# EAGLE board PX4FMUv2.4 (EAGLE 6.6.0), part 1 of 2
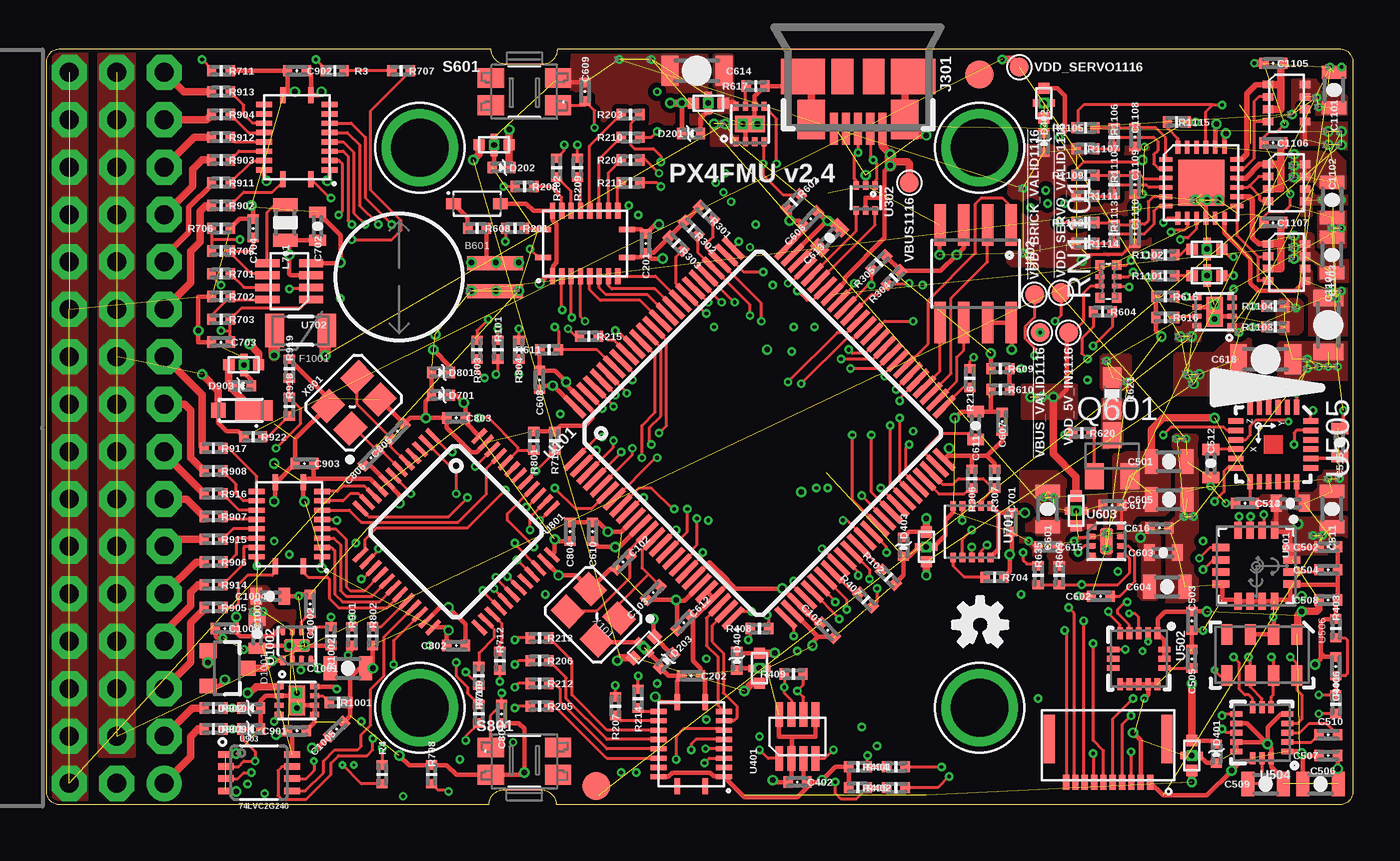
[diagram p12: board, top side]
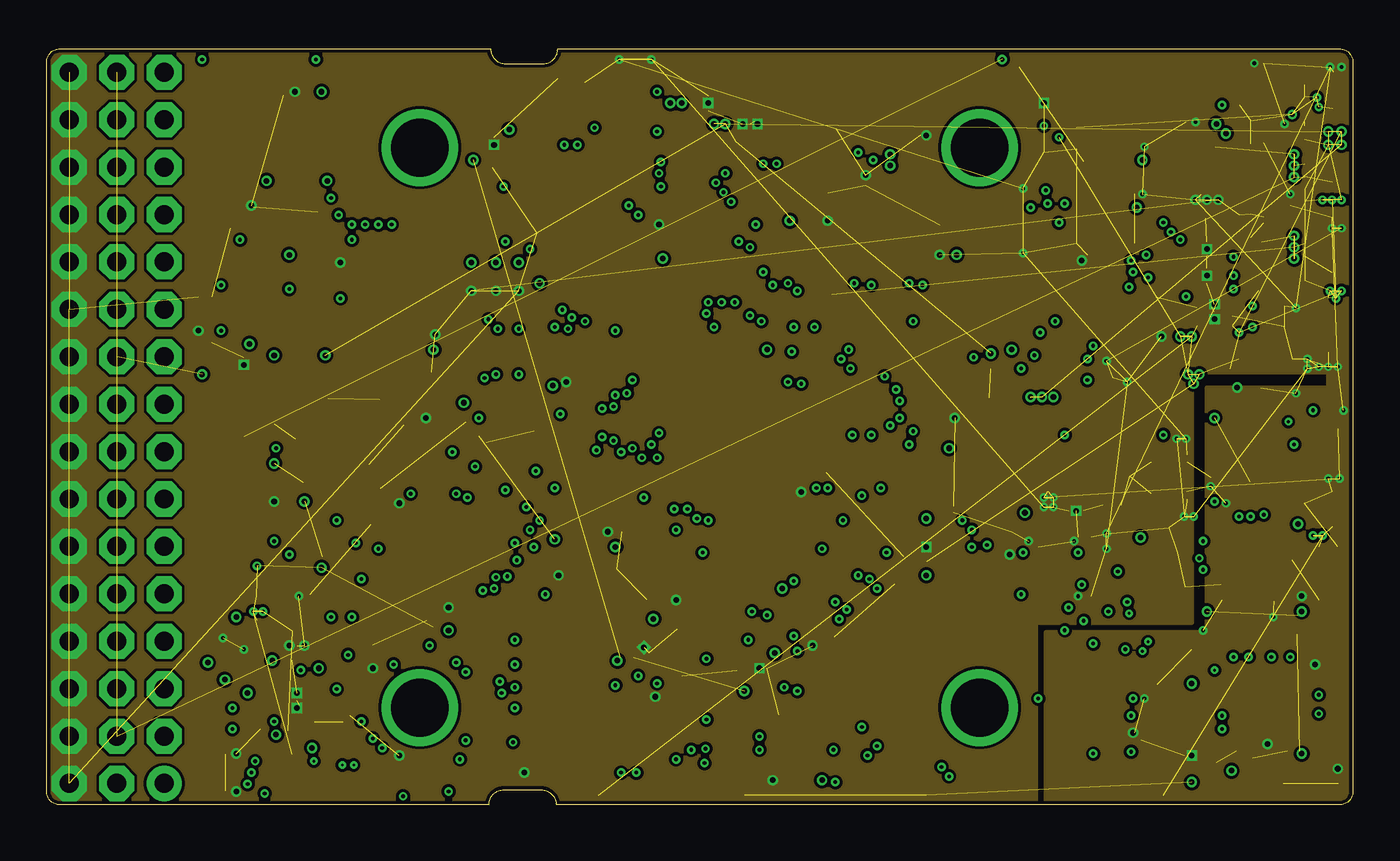
[diagram p13: board, inner layer Ground]
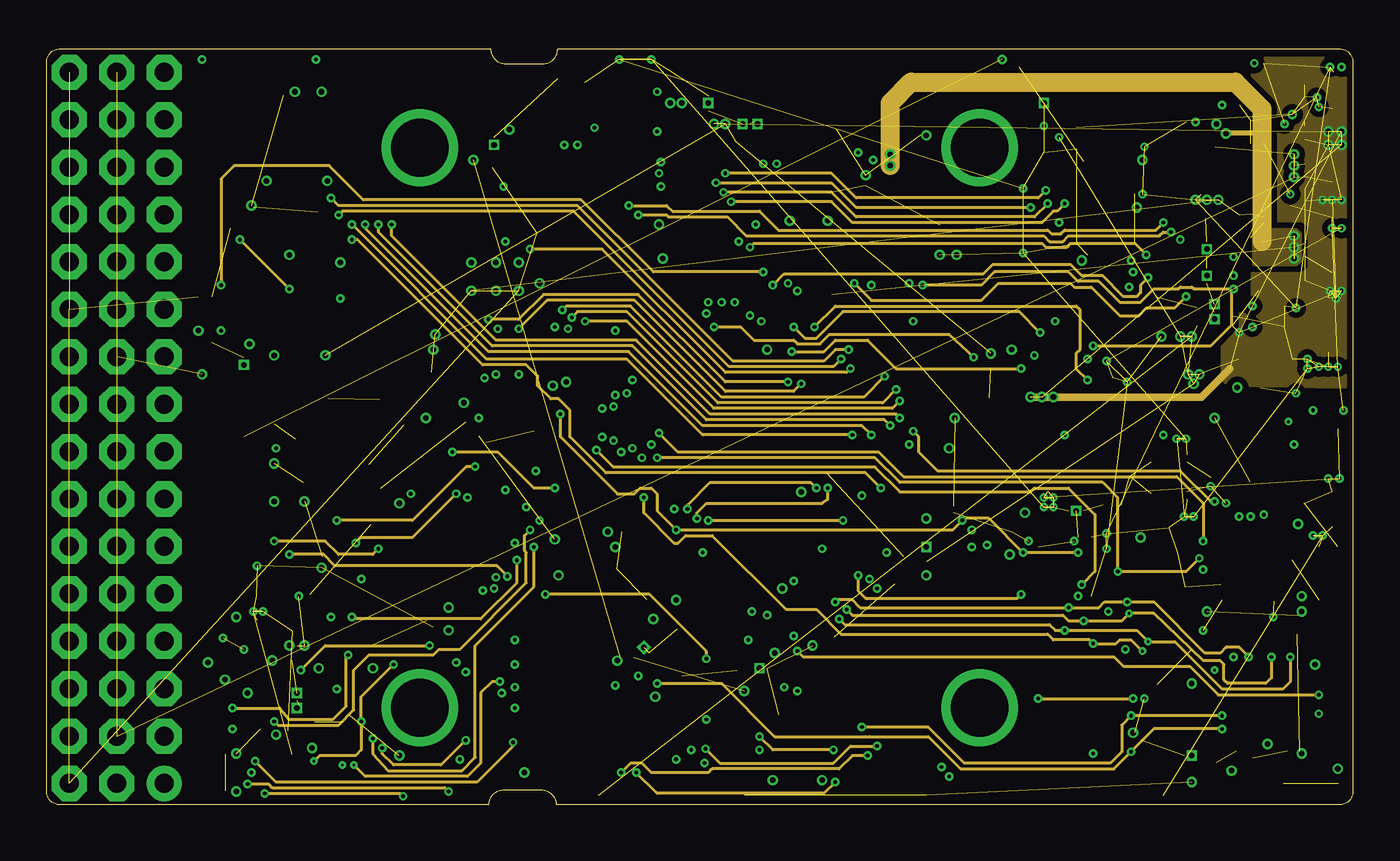
[diagram p14: board, inner layer Horizontal]
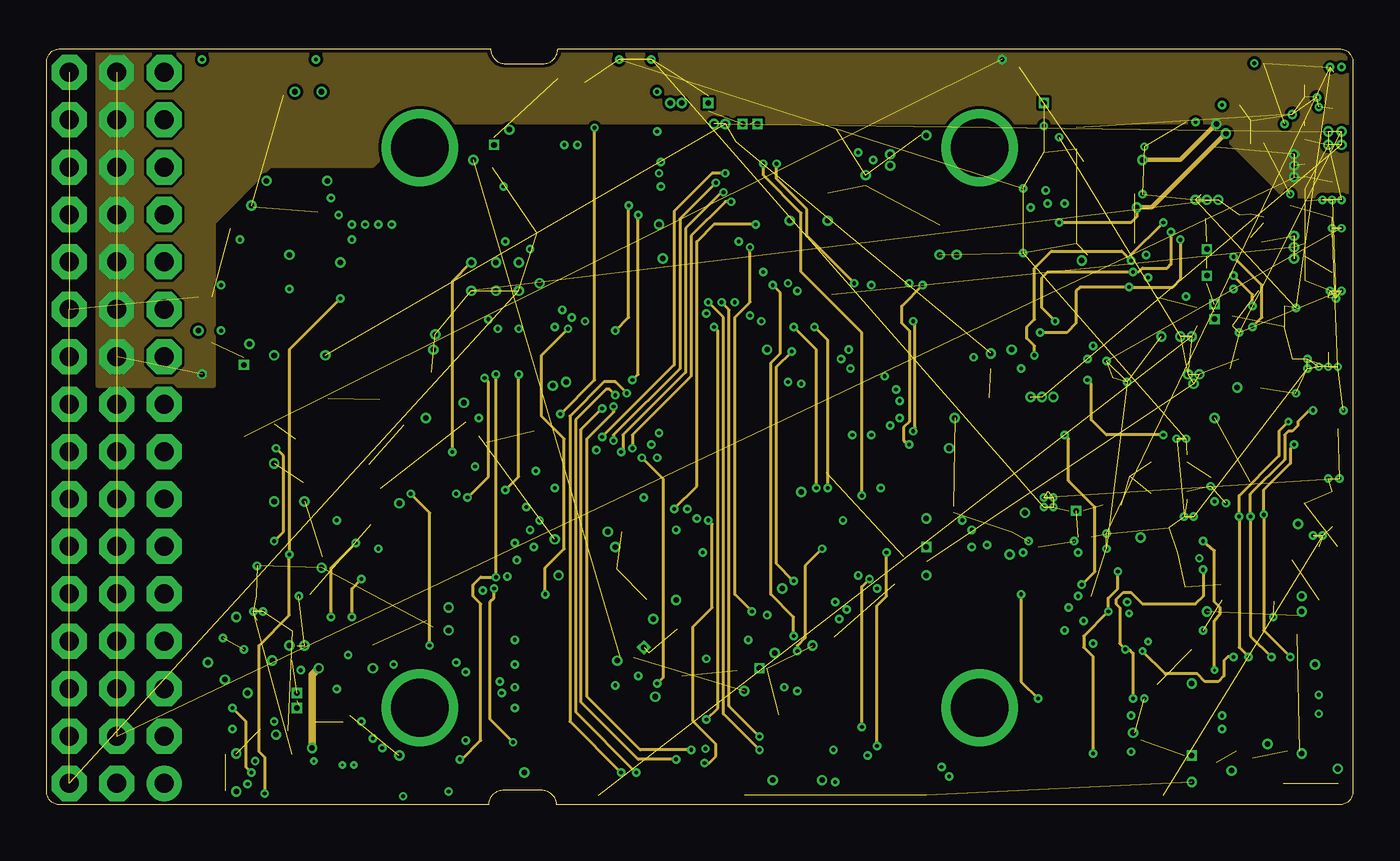
[diagram p15: board, inner layer Vertical]
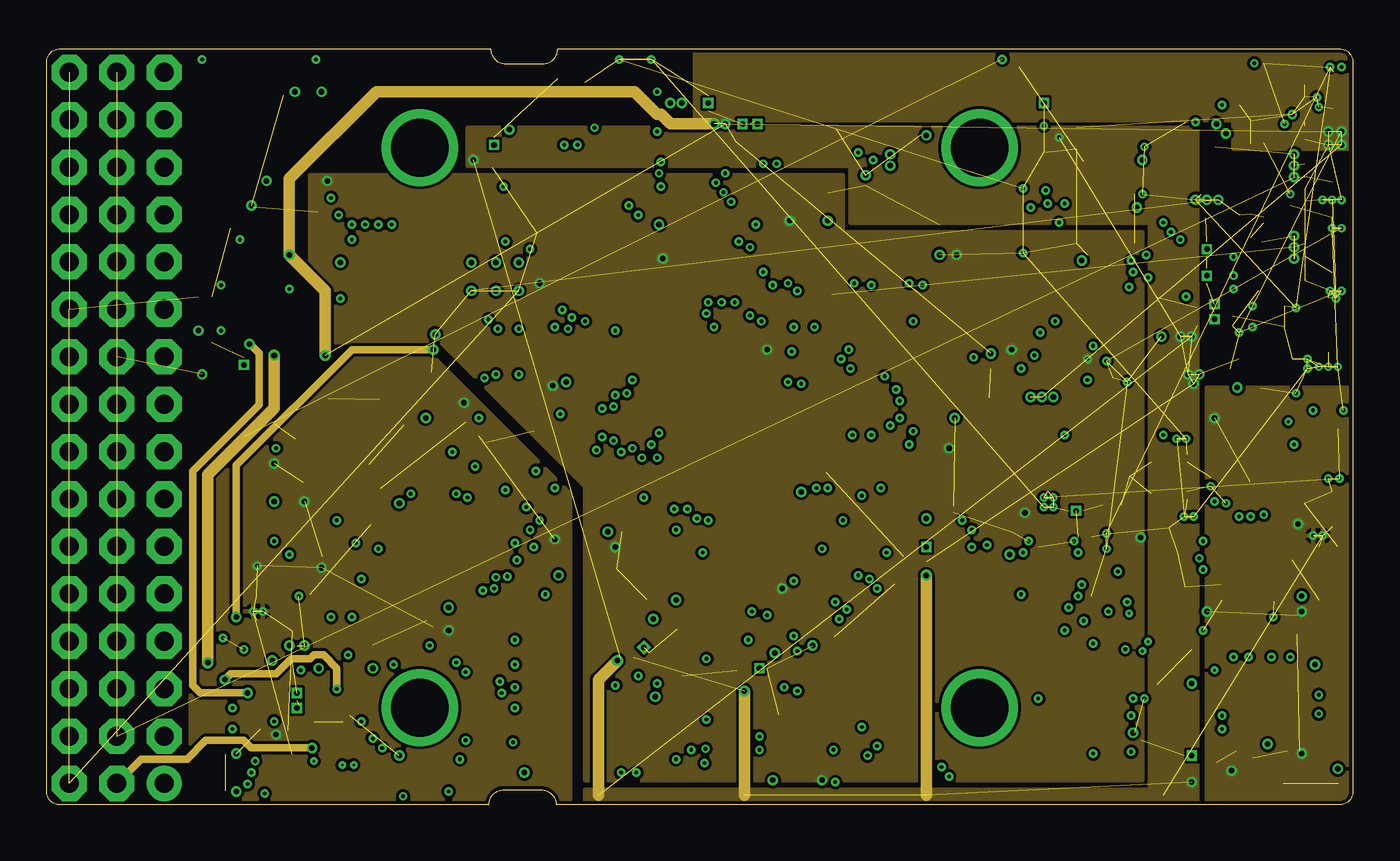
[diagram p16: board, inner layer Power]
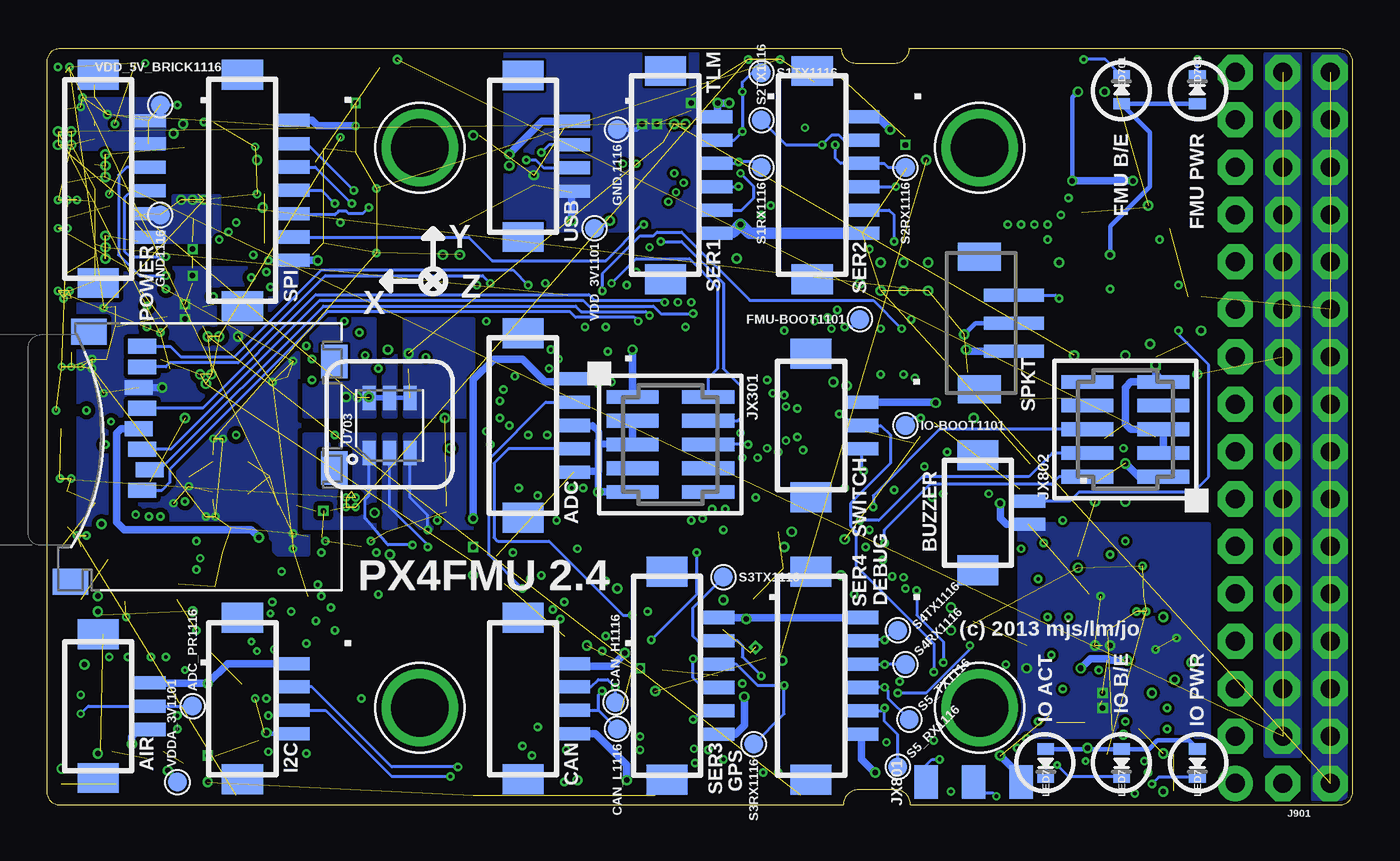
[diagram p17: board, bottom side, seen from below]

Size 70 x 40.5 mm. Coordinates in mm from the lower left corner, seen from the top.
Outline: 23.7,0 0.7,0 arc-90 0,0.7 0,39.8 arc-90 0.7,40.5 23.8,40.5 arc90 24.59,39.7 26.59,39.7 arc90 27.39,40.5 69.3,40.5 arc-90 70,39.8 70,0.7 arc-90 69.3,0 27.3,0 arc90 26.5,0.8 24.5,0.8 arc90 23.7,0
Copper layers (1*2*3*14*15*16): Top 0.035mm / dielectric 0.5mm / Ground 0.035mm / dielectric 0.15mm / Horizontal 0.035mm / dielectric 0.15mm / Vertical 0.035mm / dielectric 0.15mm / Power 0.035mm / dielectric 0.5mm / Bottom 0.035mm
Design rules "default *": minimum track width 0.15mm, minimum drill 0.2mm, track to track 5mil, track to pad 5mil, pad to pad 5mil, via to via 5mil, smd to smd 0mil, copper to edge 0.2mm, drill to drill 0.2mm, minimum pad ring 0.125mm, minimum via ring 0.125mm, stop-mask expansion 1mil, vias tented up to drill 0.31mm, thermal gap 8mil
Net classes: 0 signal: width 0.15 mm, drill 0.15 mm, clearance 0.152 mm; 1 power: width 0.15 mm, drill 0.2 mm, clearance 0.152 mm

## Footprints (pad centres in the part's own frame; a part is rotated, then mirrored left to right if it is on the bottom)
PAD.04X.04 = smd 1.016 x 1.016: P$1 0,0
MS621FE = smd 3 x 0.75: 1 5.15,0.75; 2 5.15,-0.75
0402-CAP = smd 0.5 x 0.6: P$1 -0.5,0; P$2 0.5,0
0805-CAP = smd 0.7 x 1.3: P$1 -0.95,0; P$2 0.95,0
0603-CAP = smd 0.6 x 0.9: P$1 -0.75,0; P$2 0.75,0
1206-CAP = smd 0.9 x 1.6: P$1 -1.45,0; P$2 1.45,0
MICROSMP = smd 0.8 x 0.8: ANODE 0.65,0 | smd 2 x 1.1: CATHODE -1.25,0
SOD323 = smd 0.8 x 0.6: A 1.25,0; C -1.25,0
0402-TVS = smd 0.5 x 0.6: A 0.5,0; C -0.5,0
SOT23-3 = smd 0.8 x 0.9: 1 -0.95,-1; 2 0.95,-1; 3 0,1.1
PTC-1206 = smd 1 x 1.8: 1 -1.4,0; 2 1.4,0
DF13C-6P-1.25V = smd 0.7 x 1.8: 1 -3.125,0.9; 2 -1.875,0.9; 3 -0.625,0.9; 4 0.625,0.9; 5 1.875,0.9; 6 3.125,0.9 | smd 1.6 x 2.2: M$0 5.575,-1.8; M$1 -5.575,-1.8
MOLEX-47346-0001 = smd 1.7 x 0.44: D+ 2.8,0; D- 2.8,0.65; GND 2.8,-1.3; ID 2.8,-0.65; VBUS 2.8,1.3 | smd 1.9 x 2.375: GND1 0,2.95; GND4 0,-2.95 | smd 2.1 x 1.475: GND2 2.3,2.5; GND3 2.3,-2.5 | smd 1.9 x 1.175: GND5 0,-0.838; GND6 0,0.838
DF13C-4P-1.25V = smd 0.7 x 1.8: 1 -1.875,0.9; 2 -0.625,0.9; 3 0.625,0.9; 4 1.875,0.9 | smd 1.6 x 2.2: M$0 4.325,-1.8; M$1 -4.325,-1.8
DF13C-3P-1.25V = smd 0.7 x 1.8: 1 -1.25,0.9; 2 0,0.9; 3 1.25,0.9 | smd 1.6 x 2.2: M$0 3.85,-1.8; M$1 -3.85,-1.8
DF13C-7P-1.25V = smd 0.7 x 1.8: 1 -3.75,0.9; 2 -2.5,0.9; 3 -1.25,0.9; 4 0,0.9; 5 1.25,0.9; 6 2.5,0.9; 7 3.75,0.9 | smd 1.6 x 2.2: M$0 6.2,-1.8; M$1 -6.2,-1.8
DF13C-5P-1.25V = smd 0.7 x 1.8: 1 -2.5,0.9; 2 -1.25,0.9; 3 0,0.9; 4 1.25,0.9; 5 2.5,0.9 | smd 1.6 x 2.2: M$0 4.95,-1.8; M$1 -4.95,-1.8
DF13C-2P-1.25V = smd 0.7 x 1.8: 1 -0.625,0.9; 2 0.625,0.9 | smd 1.6 x 2.2: M$0 3.075,-1.8; M$1 -3.075,-1.8
JST-ZH-SMT-VERTICAL = smd 0.7 x 3.2: P$1 -1.5,-1.75; P$2 0,-1.75; P$3 1.5,-1.75 | smd 1.5 x 2.3: P$4 3.55,0.1; P$5 -3.55,0.1
3X16RA = drill 1.016 pad 1.88: 1 2.54,19.05 | drill 1.016 pad 1.88 octagon: 2 0,19.05; 3 -2.54,19.05; 4 2.54,16.51; 5 0,16.51; 6 -2.54,16.51; 7 2.54,13.97; 8 0,13.97; 9 -2.54,13.97; 10 2.54,11.43; 11 0,11.43; 12 -2.54,11.43; 13 2.54,8.89; 14 0,8.89; 15 -2.54,8.89; 16 2.54,6.35; 17 0,6.35; 18 -2.54,6.35; 19 2.54,3.81; 20 0,3.81; 21 -2.54,3.81; 22 2.54,1.27; 23 0,1.27; 24 -2.54,1.27; 25 2.54,-1.27; 26 0,-1.27; 27 -2.54,-1.27; 28 2.54,-3.81; 29 0,-3.81; 30 -2.54,-3.81; 31 2.54,-6.35; 32 0,-6.35; 33 -2.54,-6.35; 34 2.54,-8.89; 35 0,-8.89; 36 -2.54,-8.89; 37 2.54,-11.43; 38 0,-11.43; 39 -2.54,-11.43; 40 2.54,-13.97; 41 0,-13.97; 42 -2.54,-13.97; 43 2.54,-16.51; 44 0,-16.51; 45 -2.54,-16.51; 46 2.54,-19.05; 47 0,-19.05; 48 -2.54,-19.05
FIDUCIAL-1.5X3 = smd 1.5 x 1.5: 1 0,0
FTSH-105-01-XXX-DV-K = smd 0.737 x 2.794: 1 -2.54,-2.032; 2 -2.54,2.032; 3 -1.27,-2.032; 4 -1.27,2.032; 5 0,-2.032; 6 0,2.032; 7 1.27,-2.032; 8 1.27,2.032; 9 2.54,-2.032; 10 2.54,2.032
HEADER_3X01_SMD_H_BOARD_EDGE_SHORT = smd 1.27 x 1.778: 1 -2.54,0; 2 0,0; 3 2.54,0
KYOCERA-KNH16-DA = smd 0.6 x 0.6: P$1 -0.8,0; P$2 0.8,0 | smd 0.4 x 0.4: P$3 0,-0.4; P$4 0,0.4 | drill 0.3 pad 0.4 square: P$5 0,0
0805-IND = smd 0.7 x 1.3: P$1 -0.95,0; P$2 0.95,0
0603-LED = smd 0.6 x 0.9: A 0.75,0; C -0.75,0
MOUNT-HOLE3.1 = drill 3.1 pad 4.1: P$1 0,0
SOT23-BEC = smd 1 x 1.4: B -0.95,-1.1; C 0,1.1; E 0.95,-1.1
0402-RES = smd 0.5 x 0.6: P$1 -0.5,0; P$2 0.5,0
0603-RES = smd 1.1 x 1: 1 -0.85,0; 2 0.85,0
EXB28V = smd 0.525 x 0.5: 1 -0.875,-0.45; 4 0.875,-0.45; 5 0.875,0.45; 8 -0.875,0.45 | smd 0.25 x 0.5: 2 -0.25,-0.45; 3 0.25,-0.45; 6 0.25,0.45; 7 -0.25,0.45
EVQP7J01K = smd 1.4 x 1.05: A1 -1.8,0.725; A2 1.8,0.725; B3 -1.8,-0.725; B4 1.8,-0.725
TQFP100 = smd 1.5 x 0.29: 1 -8,6; 2 -8,5.5; 3 -8,5; 4 -8,4.5; 5 -8,4; 6 -8,3.5; 7 -8,3; 8 -8,2.5; 9 -8,2; 10 -8,1.5; 11 -8,1; 12 -8,0.5; 13 -8,0; 14 -8,-0.5; 15 -8,-1; 16 -8,-1.5; 17 -8,-2; 18 -8,-2.5; 19 -8,-3; 20 -8,-3.5; 21 -8,-4; 22 -8,-4.5; 23 -8,-5; 24 -8,-5.5; 25 -8,-6; 51 8,-6; 52 8,-5.5; 53 8,-5; 54 8,-4.5; 55 8,-4; 56 8,-3.5; 57 8,-3; 58 8,-2.5; 59 8,-2; 60 8,-1.5; 61 8,-1; 62 8,-0.5; 63 8,0; 64 8,0.5; 65 8,1; 66 8,1.5; 67 8,2; 68 8,2.5; 69 8,3; 70 8,3.5; 71 8,4; 72 8,4.5; 73 8,5; 74 8,5.5; 75 8,6 | smd 0.29 x 1.5: 26 -6,-8; 27 -5.5,-8; 28 -5,-8; 29 -4.5,-8; 30 -4,-8; 31 -3.5,-8; 32 -3,-8; 33 -2.5,-8; 34 -2,-8; 35 -1.5,-8; 36 -1,-8; 37 -0.5,-8; 38 0,-8; 39 0.5,-8; 40 1,-8; 41 1.5,-8; 42 2,-8; 43 2.5,-8; 44 3,-8; 45 3.5,-8; 46 4,-8; 47 4.5,-8; 48 5,-8; 49 5.5,-8; 50 6,-8; 76 6,8; 77 5.5,8; 78 5,8; 79 4.5,8; 80 4,8; 81 3.5,8; 82 3,8; 83 2.5,8; 84 2,8; 85 1.5,8; 86 1,8; 87 0.5,8; 88 0,8; 89 -0.5,8; 90 -1,8; 91 -1.5,8; 92 -2,8; 93 -2.5,8; 94 -3,8; 95 -3.5,8; 96 -4,8; 97 -4.5,8; 98 -5,8; 99 -5.5,8; 100 -6,8
SO08 = smd 0.61 x 2.21: 1 -1.905,-2.616; 2 -0.635,-2.616; 3 0.635,-2.616; 4 1.905,-2.616; 5 1.905,2.616; 6 0.635,2.616; 7 -0.635,2.616; 8 -1.905,2.616
QFN20-RGY = smd 0.28 x 0.85: 1 -0.75,2.25; 10 -0.75,-2.25; 11 0.75,-2.25; 20 0.75,2.25 | smd 0.85 x 0.28: 2 -1.75,1.75; 3 -1.75,1.25; 4 -1.75,0.75; 5 -1.75,0.25; 6 -1.75,-0.25; 7 -1.75,-0.75; 8 -1.75,-1.25; 9 -1.75,-1.75; 12 1.75,-1.75; 13 1.75,-1.25; 14 1.75,-0.75; 15 1.75,-0.25; 16 1.75,0.25; 17 1.75,0.75; 18 1.75,1.25; 19 1.75,1.75
MICROSD = smd 0.8 x 1.5: 1 -1.94,2.7; 2 -0.84,2.3; 3 0.26,2.7; 4 1.36,2.9; 5 2.46,2.7; 6 3.56,2.9; 7 4.66,2.7; 8 5.76,2.7 | smd 1.4 x 1.9: NC -6.85,6.55; NC3 6.55,5.55 | smd 1.8 x 1.4: NC1 -0.75,-7.6; NC2 4.95,-7.6
SOT563-6 = smd 0.3 x 0.45: 1 -0.5,-0.675; 2 0,-0.675; 3 0.5,-0.675; 4 0.5,0.675; 5 0,0.675; 6 -0.5,0.675
SOT23-8 = smd 0.42 x 1.3: 1 -0.975,-1.175; 2 -0.325,-1.175; 3 0.325,-1.175; 4 0.975,-1.175; 5 0.975,1.175; 6 0.325,1.175; 7 -0.325,1.175; 8 -0.975,1.175
L3G4200DH-MAN = smd 0.9 x 0.4: 1 -1.9,0.975; 2 -1.9,0.325; 3 -1.9,-0.325; 4 -1.9,-0.975; 9 1.9,-0.975; 10 1.9,-0.325; 11 1.9,0.325; 12 1.9,0.975 | smd 0.4 x 0.9: 5 -0.975,-1.9; 6 -0.325,-1.9; 7 0.325,-1.9; 8 0.975,-1.9; 13 0.975,1.9; 14 0.325,1.9; 15 -0.325,1.9; 16 -0.975,1.9
LGA-16L = smd 0.65 x 0.3: 1 -1.37,1; 2 -1.37,0.5; 3 -1.37,0; 4 -1.37,-0.5; 5 -1.37,-1; 9 1.37,-1; 10 1.37,-0.5; 11 1.37,0; 12 1.37,0.5; 13 1.37,1 | smd 0.3 x 0.65: 6 -0.5,-1.37; 7 0,-1.37; 8 0.5,-1.37; 14 0.5,1.37; 15 0,1.37; 16 -0.5,1.37
QFN-24 = smd 0.8 x 0.29: 1 -2,1.25; 2 -2,0.75; 3 -2,0.25; 4 -2,-0.25; 5 -2,-0.75; 6 -2,-1.25; 13 2,-1.25; 14 2,-0.75; 15 2,-0.25; 16 2,0.25; 17 2,0.75; 18 2,1.25 | smd 0.29 x 0.8: 7 -1.25,-2; 8 -0.75,-2; 9 -0.25,-2; 10 0.25,-2; 11 0.75,-2; 12 1.25,-2; 19 1.25,2; 20 0.75,2; 21 0.25,2; 22 -0.25,2; 23 -0.75,2; 24 -1.25,2
MS5611-01BA = smd 1.1 x 0.6: 1 -1.1,1.875; 2 -1.1,0.625; 3 -1.1,-0.625; 4 -1.1,-1.875; 5 1.1,-1.875; 6 1.1,-0.625; 7 1.1,0.625; 8 1.1,1.875
QFN8-DSG = smd 0.28 x 0.5: 1 -0.75,-0.95; 2 -0.25,-0.95; 3 0.25,-0.95; 4 0.75,-0.95; 5 0.75,0.95; 6 0.25,0.95; 7 -0.25,0.95; 8 -0.75,0.95 | smd 1.6 x 0.9: GND 0,0 | drill 0.3 square: P$2 -0.4,0; P$3 0.4,0
MLF-8-EPAD = smd 0.5 x 0.3: 1 -0.8,0.75; 2 -0.8,0.25; 3 -0.8,-0.25; 4 -0.8,-0.75; 5 0.8,-0.75; 6 0.8,-0.25; 7 0.8,0.25; 8 0.8,0.75 | smd 0.7 x 1.4: GND 0,0
SON10 = smd 0.32 x 0.5: 1 -1,-1.375; 2 -0.5,-1.375; 3 0,-1.375; 4 0.5,-1.375; 5 1,-1.375; 6 1,1.375; 7 0.5,1.375; 8 0,1.375; 9 -0.5,1.375; 10 -1,1.375
6-PLCC = smd 1.3 x 0.7: A1 1.475,1.1; A2 1.475,0; A3 1.475,-1.1; C1 -1.475,1.1; C2 -1.475,0; C3 -1.475,-1.1
TQFP48 = smd 0.24 x 1: 1 -2.75,-4.5; 2 -2.25,-4.5; 3 -1.75,-4.5; 4 -1.25,-4.5; 5 -0.75,-4.5; 6 -0.25,-4.5; 7 0.25,-4.5; 8 0.75,-4.5; 9 1.25,-4.5; 10 1.75,-4.5; 11 2.25,-4.5; 12 2.75,-4.5; 25 2.75,4.5; 26 2.25,4.5; 27 1.75,4.5; 28 1.25,4.5; 29 0.75,4.5; 30 0.25,4.5; 31 -0.25,4.5; 32 -0.75,4.5; 33 -1.25,4.5; 34 -1.75,4.5; 35 -2.25,4.5; 36 -2.75,4.5 | smd 1 x 0.24: 13 4.5,-2.75; 14 4.5,-2.25; 15 4.5,-1.75; 16 4.5,-1.25; 17 4.5,-0.75; 18 4.5,-0.25; 19 4.5,0.25; 20 4.5,0.75; 21 4.5,1.25; 22 4.5,1.75; 23 4.5,2.25; 24 4.5,2.75; 37 -4.5,2.75; 38 -4.5,2.25; 39 -4.5,1.75; 40 -4.5,1.25; 41 -4.5,0.75; 42 -4.5,0.25; 43 -4.5,-0.25; 44 -4.5,-0.75; 45 -4.5,-1.25; 46 -4.5,-1.75; 47 -4.5,-2.25; 48 -4.5,-2.75
TSSOP8_SOT505-2 = smd 0.35 x 0.85: 1 -0.975,-1.775; 2 -0.325,-1.775; 3 0.325,-1.775; 4 0.975,-1.775; 5 0.975,1.775; 6 0.325,1.775; 7 -0.325,1.775; 8 -0.975,1.775
MO-220 = smd 0.7 x 0.25: P$1 -1.9,1.25; P$2 -1.9,0.75; P$3 -1.9,0.25; P$4 -1.9,-0.25; P$5 -1.9,-0.75; P$6 -1.9,-1.25; P$13 1.9,-1.25; P$14 1.9,-0.75; P$15 1.9,-0.25; P$16 1.9,0.25; P$17 1.9,0.75; P$18 1.9,1.25 | smd 0.25 x 0.7: P$7 -1.25,-1.9; P$8 -0.75,-1.9; P$9 -0.25,-1.9; P$10 0.25,-1.9; P$11 0.75,-1.9; P$12 1.25,-1.9; P$19 1.25,1.9; P$20 0.75,1.9; P$21 0.25,1.9; P$22 -0.25,1.9; P$23 -0.75,1.9; P$24 -1.25,1.9 | smd 2.45 x 2.45: P$25 0,0
1206-8 = smd 0.406 x 0.559: P$1 -0.991,-0.991; P$2 -0.33,-0.991; P$3 0.33,-0.991; P$4 0.991,-0.991; P$5 0.991,0.991; P$6 0.33,0.991; P$7 -0.33,0.991; P$8 -0.991,0.991
VPAC0 = drill 0.3 pad 0.55: VP 0,0
VPAC1 = drill 0.2 pad 0.45: VP 0,0
VPAC2 = drill 0.25 pad 0.5: VP 0,0
OSCILLATOR-3.2X2.5 = smd 1.4 x 1.2: 1 -1.1,-0.85; 2 1.1,-0.85; 3 1.1,0.85; 4 -1.1,0.85
51281-1094 = smd 0.34 x 0.8: 1 0,0; 2 0.5,0; 3 1,0; 4 1.5,0; 5 2,0; 6 2.5,0; 7 3,0; 8 3.5,0; 9 4,0; 10 4.5,0 | smd 0.6 x 2.6: P$11 -0.9,-2.3; P$12 5.4,-2.3

## Placement (x,y rotation side)
!VBUS_VALID1116  PAD.04  [PAD.04X.04]  53.24,25.3 270 top
!VDD_BRICK_VALID1116  PAD.04  [PAD.04X.04]  52.93,27.33 90 top
!VDD_SERVO_VALID1116  PAD.04  [PAD.04X.04]  54.36,27.43 90 top
ADC_PR1116  PAD.04  [PAD.04X.04]  62.18,5.28 270 bottom
B601  MS621FE  [MS621FE]  18.89,28.27 0 top
C101  0u1  [0402-CAP]  41.86,9.35 315 top
C102  8p  [0402-CAP]  30.89,13 225 top
C103  8p  [0402-CAP]  32.51,11.38 45 top
C201  0u1  [0402-CAP]  32.11,30.07 90 top
C202  0u1  [0402-CAP]  34.54,6.91 180 top
C401  0u1  [0402-CAP]  69.09,7.42 90 top
C402  0u1  [0402-CAP]  40.23,1.22 180 top
C501  10u/10V  [0805-CAP]  60.15,18.39 0 top
C502  0u1  [0402-CAP]  68.68,13.82 0 top
C503  0u1  [0402-CAP]  61.37,9.86 270 top
C504  10n  [0402-CAP]  68.68,12.6 0 top
C505  10n  [0402-CAP]  61.37,7.82 90 top
C506  10u/10V  [0805-CAP]  68.28,1.12 0 top
C507  0u1  [0402-CAP]  68.68,2.64 0 top
C508  0u1  [0402-CAP]  68.68,10.97 0 top
C509  10u/10V  [0805-CAP]  65.33,1.12 0 top
C510  0u47  [0402-CAP]  68.68,3.76 0 top
C511  10u/10V  [0805-CAP]  68.88,15.85 90 top
C512  2u2  [0603-CAP]  62.38,18.29 270 top
C513  2u2  [0603-CAP]  66.65,16.15 0 top
C514  0u1  [0402-CAP]  64.21,16.15 180 top
C515  0u01  [0603-CAP]  69.29,19.41 90 top
C601  10u/25V  [0805-CAP]  53.64,15.85 90 top
C602  10n  [0402-CAP]  56.49,11.18 0 top
C603  1u  [0603-CAP]  59.84,13.51 0 top
C604  22u/25V  [0805-CAP]  60.05,11.68 0 top
C605  22u/25V  [0805-CAP]  60.15,16.36 0 top
C606  0u1  [0402-CAP]  40.94,31.39 45 top
C607  0u1  [0402-CAP]  51.21,20.52 90 top
C608  0u1  [0402-CAP]  26.42,22.76 90 top
C609  0u1  [0402-CAP]  28.85,38.2 270 top
C610  0u1  [0402-CAP]  29.26,14.63 90 top
C611  2u2  [0603-CAP]  49.78,20.32 90 top
C612  0u1  [0402-CAP]  34.14,9.75 225 top
C613  2u2  [0603-CAP]  41.96,30.38 45 top
C614  100u  [1206-CAP]  34.85,39.32 180 top
C615  0u1  [0402-CAP]  53.64,13.82 180 top
C616  0u1  [0402-CAP]  59.64,14.83 0 top
C617  0u1  [0402-CAP]  57.1,16.05 180 top
C618  100u  [1206-CAP]  65.33,23.88 0 top
C701  0u1  [0402-CAP]  51.71,15.14 270 top
C702  1u0  [0603-CAP]  14.53,30.99 90 top
C703  5n6  [0402-CAP]  9.35,24.79 180 top
C704  0u47  [0402-CAP]  11.07,30.89 90 top
C801  0u1  [0402-CAP]  24.38,4.88 90 top
C802  0u1  [0402-CAP]  21.95,8.53 0 top
C803  0u1  [0402-CAP]  21.95,20.73 180 top
C804  0u1  [0402-CAP]  28.04,14.63 90 top
C805  8p  [0402-CAP]  18.8,20.02 45 top
C806  8p  [0402-CAP]  17.37,18.59 45 top
C901  0u1  [0402-CAP]  13.41,3.96 0 top
C902  0u1  [0402-CAP]  13.41,39.32 180 top
C903  0u1  [0402-CAP]  13.82,18.29 180 top
C1001  10u/25V  [0805-CAP]  16.15,7.32 0 top
C1002  10n  [0402-CAP]  14.12,10.77 90 top
C1003  1u0  [0603-CAP]  11.28,9.14 270 top
C1004  10u  [0603-CAP]  11.99,11.18 0 top
C1005  0u1F  [0402-CAP]  15.54,4.06 45 top
C1008  2u2  [0402-CAP]  9.55,9.45 180 top
C1101  22u/25V  [0805-CAP]  68.99,38.3 90 top
C1102  22u/25V  [0805-CAP]  68.88,32.41 270 top
C1103  22u/25V  [0805-CAP]  68.88,29.46 90 top
C1104  100u  [1206-CAP]  68.68,25.7 270 top
C1105  0u1  [0402-CAP]  65.74,39.73 180 top
C1106  0u1  [0402-CAP]  65.74,35.46 180 top
C1107  0u1  [0402-CAP]  65.74,31.19 180 top
C1108  1000p/25V  [0402-CAP]  58.32,35.76 270 top
C1109  1000p/25V  [0402-CAP]  58.32,33.22 270 top
C1110  1000p/25V  [0402-CAP]  58.32,30.58 270 top
CAN_H1116  PAD.04  [PAD.04X.04]  39.52,5.49 90 bottom
CAN_L1116  PAD.04  [PAD.04X.04]  39.42,4.06 270 bottom
D1  MSS1P4-M3  [MICROSMP]  9.86,21.13 180 top
D2  RB751V40T1G  [SOD323]  23.06,32.21 0 top
D201  PESD0402-140  [0402-TVS]  34.54,35.97 0 top
D202  PESD0402-140  [0402-TVS]  24.38,34.14 180 top
D203  PESD0402-140  [0402-TVS]  33.22,7.72 225 top
D401  PESD0402-140  [0402-TVS]  62.69,2.74 270 top
D402  PESD0402-140  [0402-TVS]  53.44,35.46 270 top
D403  PESD0402-140  [0402-TVS]  45.92,13.82 270 top
D404  PESD0402-140  [0402-TVS]  36.98,7.72 270 top
D701  PESD0402-140  [0402-TVS]  21.13,21.95 180 top
D801  PESD0402-140  [0402-TVS]  21.13,23.16 180 top
D901  PESD0402-140  [0402-TVS]  10.97,4.06 0 top
D902  PESD0402-140  [0402-TVS]  10.97,5.18 0 top
D903  PESD0402-140  [0402-TVS]  10.46,22.45 0 top
D1001  PMEG2005CT  [SOT23-3]  9.65,7.32 270 top
F1001  0ZCA0035FF2G  [PTC-1206]  13.61,25.4 180 top
FMU-BOOT1101  PAD.04  [PAD.04X.04]  26.42,26.01 0 bottom
GND1116  PAD.04  [PAD.04X.04]  63.91,31.6 270 bottom
GND.1116  PAD.04  [PAD.04X.04]  39.42,36.17 0 bottom
IO-BOOT1101  PAD.04  [PAD.04X.04]  23.98,20.32 0 bottom
J201  DF13C-6P-1.25V  [DF13C-6P-1.25V]  35.04,33.74 270 bottom
J202  DF13C-6P-1.25V  [DF13C-6P-1.25V]  27.17,33.74 270 bottom
J203  DF13C-6P-1.25V  [DF13C-6P-1.25V]  34.95,6.91 270 bottom
J204  DF13C-6P-1.25V  [DF13C-6P-1.25V]  27.23,6.91 270 bottom
J301  47346-0001  [MOLEX-47346-0001]  43.48,39.01 270 top
J302  DF13C-4P-1.25V  [DF13C-4P-1.25V]  42.67,34.75 270 bottom
J401  DF13C-4P-1.25V  [DF13C-4P-1.25V]  57.71,5.69 270 bottom
J402  DF13C-3P-1.25V  [DF13C-3P-1.25V]  65.43,5.28 270 bottom
J403  DF13C-7P-1.25V  [DF13C-7P-1.25V]  57.71,32.92 270 bottom
J404  DF13C-5P-1.25V  [DF13C-5P-1.25V]  42.67,20.32 270 bottom
J405  DF13C-4P-1.25V  [DF13C-4P-1.25V]  42.67,5.69 270 bottom
J601  DF13C-6P-1.25V  [DF13C-6P-1.25V]  65.43,33.53 270 bottom
J701  DF13C-2P-1.25V  [DF13C-2P-1.25V]  18.29,15.65 270 bottom
J702  DF13C-3P-1.25V  [DF13C-3P-1.25V]  27.23,20.32 270 bottom
J801  JST-ZH-3  [JST-ZH-SMT-VERTICAL]  19.91,25.81 90 bottom
J901  [3X16RA]  3.76,20.19 180 bottom
JP1  FIDUCIAL1.5X3  [FIDUCIAL-1.5X3]  49.99,39.12 0 top
JP2  FIDUCIAL1.5X3  [FIDUCIAL-1.5X3]  29.46,1.02 0 top
JX301  ARM_MINI_JTAG-SMT  [FTSH-105-01-XXX-DV-K]  36.58,19.3 270 bottom
JX801  HEADER-3X1BOARDEDGE-SHORT  [HEADER_3X01_SMD_H_BOARD_EDGE_SHORT]  20.32,1.22 0 bottom
JX802  ARM_MINI_JTAG-SMT  [FTSH-105-01-XXX-DV-K]  12.19,20.12 90 bottom
L201  KNH16C104DA5TS  [KYOCERA-KNH16-DA]  35.46,37.59 180 top
L202  KNH16C104DA5TS  [KYOCERA-KNH16-DA]  23.98,35.36 0 top
L203  KNH16C104DA5TS  [KYOCERA-KNH16-DA]  32,8.43 45 top
L401  KNH16C104DA5TS  [KYOCERA-KNH16-DA]  61.37,2.64 90 top
L402  KNH16C104DA5TS  [KYOCERA-KNH16-DA]  53.44,37.59 270 top
L403  KNH16C104DA5TS  [KYOCERA-KNH16-DA]  38.2,7.32 90 top
L404  KNH16C104DA5TS  [KYOCERA-KNH16-DA]  47.14,13.82 90 top
L603  KNH16C104DA5TS  [KYOCERA-KNH16-DA]  55.17,15.75 270 top
L701  47uH  [0805-IND]  12.8,31.19 90 top
L901  KNH16C104DA5TS  [KYOCERA-KNH16-DA]  10.57,23.57 0 top
L1101  KNH16C104DA5TS  [KYOCERA-KNH16-DA]  62.18,28.35 180 top
L1102  KNH16C104DA5TS  [KYOCERA-KNH16-DA]  62.18,29.77 180 top
LED701  AMBER  [0603-LED]  12.4,38.3 270 bottom
LED702  GREEN  [0603-LED]  8.33,2.24 90 bottom
LED703  AMBER  [0603-LED]  12.4,2.24 90 bottom
LED704  GREEN  [0603-LED]  8.33,38.3 270 bottom
LED705  BLUE  [0603-LED]  16.46,2.24 90 bottom
M3_MOUNT1101  MOUNT-HOLE3.1MM  [MOUNT-HOLE3.1]  20,35.2 0 top
M3_MOUNT1102  MOUNT-HOLE3.1MM  [MOUNT-HOLE3.1]  50,5.2 0 top
M3_MOUNT1103  MOUNT-HOLE3.1MM  [MOUNT-HOLE3.1]  50,35.2 0 top
M3_MOUNT1104  MOUNT-HOLE3.1MM  [MOUNT-HOLE3.1]  20,5.2 0 top
OSHW_LOGO1116  OSHW-LOGOS  [OSHW-LOGO-S]  50.03,9.65 0 top
Q601  MMBT3906LT1SMD  [SOT23-BEC]  57.1,18.69 0 top
R3  220R  [0402-RES]  15.44,39.32 180 top
R4  220R  [0402-RES]  17.98,1.63 270 top
R101  470R  [0402-RES]  24.18,24.38 270 top
R102  10K  [0402-RES]  45.11,12.19 315 top
R201  120R  [0402-RES]  25.1,30.89 180 top
R202  120R  [0402-RES]  27.33,34.14 90 top
R203  120R  [0402-RES]  31.29,36.98 0 top
R204  120R  [0402-RES]  31.29,34.54 0 top
R205  120R  [0402-RES]  26.42,5.28 180 top
R206  120R  [0402-RES]  26.42,7.72 180 top
R207  120R  [0402-RES]  30.48,5.28 90 top
R208  120R  [0402-RES]  25.6,33.12 180 top
R209  120R  [0402-RES]  28.45,34.14 90 top
R210  120R  [0402-RES]  31.29,35.76 0 top
R211  120R  [0402-RES]  31.29,33.32 0 top
R212  120R  [0402-RES]  26.42,6.5 180 top
R213  120R  [0402-RES]  26.42,8.94 180 top
R214  120R  [0402-RES]  31.7,5.69 90 top
R215  120R  [0402-RES]  29.06,25.1 180 top
R216  120R  [0402-RES]  49.48,22.86 90 top
R301  100K  [0402-RES]  35.36,31.7 135 top
R302  100K  [0402-RES]  34.54,30.89 135 top
R303  100K  [0402-RES]  33.73,30.07 135 top
R304  100K  [0402-RES]  45.42,28.24 45 top
R305  100K  [0402-RES]  44.6,29.06 45 top
R306  1K5  [0402-RES]  49.58,17.48 90 top
R307  1K5  [0402-RES]  50.8,17.48 90 top
R401  1K5  [0402-RES]  43.48,2.03 180 top
R402  1K5  [0402-RES]  43.48,0.91 180 top
R403  10K/0.1%  [0402-RES]  69.09,9.45 270 top
R404  120R  [0402-RES]  45.52,2.03 0 top
R405  120R  [0402-RES]  45.52,0.91 0 top
R406  10K/0.1%  [0402-RES]  69.09,5.38 270 top
R407  10K/0.1%  [0402-RES]  43.89,10.97 315 top
R408  10K/0.1%  [0402-RES]  38.2,9.45 0 top
R409  120R  [0402-RES]  40.03,7.01 0 top
R602  1M  [0402-RES]  40.03,32.31 225 top
R603  10k  [0402-RES]  54.25,12.29 270 top
R604  1M  [0402-RES]  56.59,26.42 180 top
R608  1K  [0402-RES]  23.06,30.89 180 top
R609  10K/0.1%  [0402-RES]  51.1,23.37 180 top
R610  10K/0.1%  [0402-RES]  51.1,22.25 180 top
R611  10K  [0402-RES]  26.92,24.38 0 top
R615  10K  [0402-RES]  59.94,27.23 180 top
R616  25K5  [0402-RES]  59.94,26.11 180 top
R617  16K5  [0402-RES]  38,38.51 0 top
R620  1k8  [0402-RES]  55.47,19.91 180 top
R621  10R  [0603-RES]  57.1,22.05 270 top
R635  DNP / 10k  [0402-RES]  53.14,12.29 270 top
R701  9K09  [0402-RES]  9.35,28.45 180 top
R702  10K  [0402-RES]  9.35,27.23 180 top
R703  100K  [0402-RES]  9.35,26.01 180 top
R704  10K  [0402-RES]  50.8,12.19 180 top
R705  453K  [0402-RES]  9.35,29.67 180 top
R706  16K5  [0402-RES]  9.35,30.89 0 top
R707  220R  [0402-RES]  19,39.32 180 top
R708  220R  [0402-RES]  20.62,1.63 270 top
R709  220R  [0402-RES]  23.16,4.88 270 top
R710  68R  [0402-RES]  23.16,6.91 90 top
R711  220R  [0402-RES]  9.35,39.32 180 top
R712  220R  [0402-RES]  24.28,7.72 270 top
R713  1K5  [0402-RES]  27.23,19.51 90 top
R801  10K  [0402-RES]  26.11,19.51 90 top
R802  10K  [0402-RES]  17.48,9.04 270 top
R803  220R  [0402-RES]  23.06,24.38 90 top
R804  220R  [0402-RES]  25.3,24.38 90 top
R901  10K  [0402-RES]  16.36,9.04 270 top
R902  220R  [0402-RES]  9.35,32.11 180 top
R903  220R  [0402-RES]  9.35,34.54 180 top
R904  220R  [0402-RES]  9.35,36.98 180 top
R905  220R  [0402-RES]  8.94,10.57 180 top
R906  220R  [0402-RES]  8.94,13 180 top
R907  220R  [0402-RES]  8.94,15.44 180 top
R908  220R  [0402-RES]  8.94,17.88 180 top
R909  220R  [0402-RES]  8.94,4.06 180 top
R910  220R  [0402-RES]  8.94,5.18 180 top
R911  220R  [0402-RES]  9.35,33.32 180 top
R912  220R  [0402-RES]  9.35,35.76 180 top
R913  220R  [0402-RES]  9.35,38.2 180 top
R914  220R  [0402-RES]  8.94,11.79 180 top
R915  220R  [0402-RES]  8.94,14.22 180 top
R916  220R  [0402-RES]  8.94,16.66 180 top
R917  220R  [0402-RES]  8.94,19.1 180 top
R918  10K/0.1%  [0402-RES]  13,21.34 270 top
R919  10K/0.1%  [0402-RES]  13,23.37 270 top
R922  10K/0.1%  [0402-RES]  11.07,19.71 180 top
R1001  100K  [0402-RES]  15.65,5.49 180 top
R1002  10K  [0402-RES]  15.24,9.04 90 top
R1101  10K/0.1%  [0402-RES]  59.94,28.35 0 top
R1102  10K/0.1%  [0402-RES]  59.94,29.46 0 top
R1103  1M  [0402-RES]  65.84,25.6 0 top
R1104  1M  [0402-RES]  65.84,26.72 0 top
R1105  453K  [0402-RES]  55.68,36.27 0 top
R1106  56K  [0402-RES]  57.2,35.76 270 top
R1107  105K  [0402-RES]  55.68,35.15 180 top
R1109  453K  [0402-RES]  55.68,33.73 0 top
R1110  56K  [0402-RES]  57.2,33.22 270 top
R1111  105K  [0402-RES]  55.68,32.61 180 top
R1112  453K  [0402-RES]  55.68,31.19 0 top
R1113  56K  [0402-RES]  57.2,30.58 270 top
R1114  105K  [0402-RES]  55.68,30.07 180 top
R1115  0R  [0402-RES]  60.55,36.58 180 top
RN1101  1M  [EXB28V]  56.9,28.04 90 top
S1RX1116  PAD.04  [PAD.04X.04]  31.7,34.14 270 bottom
S1TX1116  PAD.04  [PAD.04X.04]  31.7,39.22 0 bottom
S2RX1116  PAD.04  [PAD.04X.04]  23.98,34.14 270 bottom
S2TX1116  PAD.04  [PAD.04X.04]  31.7,36.68 90 bottom
S3RX1116  PAD.04  [PAD.04X.04]  32.11,3.25 270 bottom
S3TX1116  PAD.04  [PAD.04X.04]  33.73,12.19 0 bottom
S4RX1116  PAD.04  [PAD.04X.04]  23.98,7.52 45 bottom
S4TX1116  PAD.04  [PAD.04X.04]  24.38,9.35 45 bottom
S5_RX1116  PAD.04  [PAD.04X.04]  24.38,2.03 45 bottom
S5_TX1116  PAD.04  [PAD.04X.04]  23.77,4.57 45 bottom
S601  RESET  [EVQP7J01K]  25.6,38.2 180 top
S801  RESET  [EVQP7J01K]  25.6,2.34 0 top
U101  STM32F4X7VX  [TQFP100]  38.2,19.91 45 top
U102  FM25V01  [SO08]  49.78,28.45 180 top
U201  TXS0108QFN20  [QFN20-RGY]  28.85,30.07 90 top
U202  TXS0108QFN20  [QFN20-RGY]  34.54,3.25 180 top
U301  2908-05WB-MG  [MICROSD]  62.18,18.8 90 bottom
U302  NUF2042XV6  [SOT563-6]  43.89,32.51 180 top
U401  MAX3051  [SOT23-8]  40.23,3.66 0 top
U501  L3GD20  [L3G4200DH-MAN]  64.82,12.8 270 top
U502  L3GD20H  [LGA-16L]  58.52,7.82 270 top
U504  LSM303D  [LGA-16L]  65.13,3.86 180 top
U505  MPU-6000  [QFN-24]  65.74,19.3 270 top
U506  MS5611-01BA  [MS5611-01BA]  65.13,8.03 270 top
U601  BQ24315  [QFN8-DSG]  37.69,36.47 0 top
U602  BQ24315  [QFN8-DSG]  62.59,26.42 90 top
U603  MIC5332  [MLF-8-EPAD]  56.79,14.12 0 top
U701  TCA62724FMG  [SON10]  49.58,14.63 180 top
U702  LT3469  [SOT23-8]  13,28.04 90 top
U703  LRTB GFTG-T7AW-1+V7A7-29+R5T9-49-L  [6-PLCC]  51.61,20.32 90 bottom
U801  STM32F10XCXT6  [TQFP48]  21.95,14.63 225 top
U901  TXS0108QFN20  [QFN20-RGY]  13.41,35.76 180 top
U902  TXS0108QFN20  [QFN20-RGY]  13,15.04 180 top
U903  74LVC2G240  [TSSOP8_SOT505-2]  11.38,1.73 270 top
U1001  BQ24313  [QFN8-DSG]  13.41,5.59 270 top
U1002  MIC5332  [MLF-8-EPAD]  13.41,8.53 90 top
U1101  LTC4417  [MO-220]  61.87,33.32 0 top
U1102  NTHD4102PT1G  [1206-8]  66.45,37.59 270 top
U1103  NTHD4102PT1G  [1206-8]  66.45,33.32 270 top
U1104  NTHD4102PT1G  [1206-8]  66.45,29.06 270 top
VBUS1116  PAD.04  [PAD.04X.04]  46.23,33.32 270 top
VDD_3V1101  PAD.04  [PAD.04X.04]  40.64,30.89 0 bottom
VDD_5V_BRICK1116  PAD.04  [PAD.04X.04]  63.91,37.49 270 bottom
VDD_5V_IN1116  PAD.04  [PAD.04X.04]  54.76,25.3 270 top
VDD_SERVO1116  PAD.04  [PAD.04X.04]  52.12,39.52 0 top
VDDA_3V1101  PAD.04  [PAD.04X.04]  62.99,1.22 0 bottom
VP_0  VPDEV0  [VPAC0]  25.3,27.53 0 top
VP_1  VPDEV0  [VPAC0]  22.76,27.53 0 top
VP_2  VPDEV0  [VPAC0]  62.79,32.41 0 top
VP_3  VPDEV0  [VPAC0]  61.57,32.41 0 top
VP_4  VPDEV1  [VPAC1]  66.95,26.62 0 top
VP_5  VPDEV1  [VPAC1]  68.78,39.52 0 top
VP_6  VPDEV1  [VPAC1]  56.79,14.53 0 top
VP_7  VPDEV1  [VPAC1]  56.79,13.72 0 top
VP_8  VPDEV1  [VPAC1]  57.91,22.66 0 top
VP_9  VPDEV1  [VPAC1]  56.79,23.77 0 top
VP_10  VPDEV1  [VPAC1]  69.39,30.89 0 top
VP_11  VPDEV1  [VPAC1]  68.88,30.89 0 top
VP_12  VPDEV1  [VPAC1]  69.19,23.47 0 top
VP_13  VPDEV1  [VPAC1]  68.68,23.47 0 top
VP_14  VPDEV1  [VPAC1]  67.56,23.88 0 top
VP_15  VPDEV1  [VPAC1]  68.17,23.47 0 top
VP_16  VPDEV1  [VPAC1]  67.56,23.37 0 top
VP_17  VPDEV1  [VPAC1]  61.47,15.44 0 top
VP_18  VPDEV1  [VPAC1]  60.96,15.44 0 top
VP_19  VPDEV1  [VPAC1]  60.55,19.61 0 top
VP_20  VPDEV1  [VPAC1]  61.06,19.61 0 top
VP_21  VPDEV1  [VPAC1]  52.32,29.57 0 top
VP_22  VPDEV1  [VPAC1]  52.32,33.02 0 top
VP_23  VPDEV1  [VPAC1]  30.68,39.93 0 top
VP_24  VPDEV1  [VPAC1]  32.41,39.93 0 top
VP_25  VPDEV1  [VPAC1]  53.44,15.95 0 top
VP_26  VPDEV1  [VPAC1]  53.95,15.95 0 top
VP_27  VPDEV1  [VPAC1]  53.95,16.46 0 top
VP_28  VPDEV1  [VPAC1]  53.44,16.46 0 top
VP_29  VPDEV1  [VPAC1]  69.29,17.48 0 top
VP_30  VPDEV1  [VPAC1]  68.68,17.48 0 top
VP_31  VPDEV1  [VPAC1]  11.07,10.36 0 top
VP_32  VPDEV1  [VPAC1]  11.58,10.36 0 top
VP_33  VPDEV0  [VPAC0]  66.85,29.87 0 top
VP_34  VPDEV0  [VPAC0]  66.85,29.26 0 top
VP_35  VPDEV0  [VPAC0]  66.85,30.48 0 top
VP_36  VPDEV1  [VPAC1]  68.38,14.43 0 top
VP_37  VPDEV1  [VPAC1]  67.87,14.43 0 top
VP_38  VPDEV2  [VPAC2]  66.75,36.98 0 top
VP_39  VPDEV1  [VPAC1]  68.07,37.9 0 top
VP_40  VPDEV1  [VPAC1]  68.17,37.39 0 top
VP_41  VPDEV0  [VPAC0]  36.37,36.47 0 top
VP_42  VPDEV0  [VPAC0]  68.68,36.07 0 top
VP_43  VPDEV0  [VPAC0]  68.68,35.36 0 top
VP_44  VPDEV1  [VPAC1]  69.39,32.41 0 top
VP_45  VPDEV1  [VPAC1]  68.38,32.41 0 top
VP_46  VPDEV1  [VPAC1]  68.88,32.41 0 top
VP_47  VPDEV1  [VPAC1]  69.09,27.13 0 top
VP_48  VPDEV1  [VPAC1]  68.78,27.53 0 top
VP_49  VPDEV1  [VPAC1]  69.39,27.53 0 top
VP_50  VPDEV1  [VPAC1]  63.91,25.3 0 top
VP_51  VPDEV0  [VPAC0]  69.39,36.07 0 top
VP_52  VPDEV0  [VPAC0]  69.39,35.36 0 top
VP_53  VPDEV0  [VPAC0]  53.34,21.84 0 top
VP_54  VPDEV0  [VPAC0]  61.37,25.1 0 top
VP_55  VPDEV0  [VPAC0]  60.76,25.1 0 top
VP_56  VPDEV0  [VPAC0]  61.16,23.06 0 top
VP_57  VPDEV0  [VPAC0]  61.77,23.06 0 top
VP_58  VPDEV0  [VPAC0]  61.47,22.56 0 top
VP_59  VPDEV0  [VPAC0]  66.85,33.63 0 top
VP_60  VPDEV0  [VPAC0]  66.85,34.24 0 top
VP_61  VPDEV0  [VPAC0]  66.85,34.85 0 top
X101  3.2x2.5 mm / 24 MHz / 15 ppm  [OSCILLATOR-3.2X2.5]  29.29,10.18 135 top
X503  0512811094  [51281-1094]  59.13,1.22 180 top
X801  3.2x2.5 mm / 24 MHz / 15 ppm  [OSCILLATOR-3.2X2.5]  16.46,21.54 45 top

## Tracks (layer width: path | path; a pad name or v marks a point on that pad's centre or on a via)
!ACCEL_MAG_CS  (via drill 0.15, 0.2)
  Top 0.152: U101.9 31.92,16.46 v32,16.46 | 64.63,5.28 U504.8 64.63,5.68 64.41,5.89 64.21,5.89 63.91,6.2 63.91,7.62 v63.6,7.92 | X503.6 56.63,2.91 56.08,3.45 v56.08,8.64
  Horizontal 0.152: v32,16.46 32,15.65 33.63,14.02 33.83,14.02 34.24,14.43 35.66,14.43 39.62,10.46 41.25,10.46 42.57,9.14 53.65,9.14 53.95,8.84 55.88,8.84 v56.08,8.64 57.3,8.64 57.51,8.84 58.12,8.84 v58.73,8.23
  Vertical 0.152: v63.6,7.92 63.3,7.92 63.09,7.72 63.09,6.91 62.79,6.6 62.08,6.6 61.67,7.01 59.94,7.01 v58.73,8.23
!BARO_CS  (via drill 0.15, 0.2)
  Top 0.152: v32.82,19.91 33.22,20.32 33.22,24.89 U101.88 | U101.88 | v62.59,7.21 62.87,6.93 U506.5
  Horizontal 0.152: v32.82,19.91 33.83,18.9 44.6,18.9 45.92,17.58 60.55,17.58 61.98,16.15 v61.98,14.12
  Vertical 0.152: v62.59,7.21 62.59,9.86 62.89,10.26 62.89,10.57 62.59,10.87 62.59,13.61 v61.98,14.12
!FMU-LED_AMBER  (via drill 0.2)
  Top 0.152: U101.43 44.7,16.95 v44.7,16.97 | R707.P$1 17.98,37.79 17.37,37.19 17.37,32.92 19,31.29 19,30.79 18.49,30.28 v16.36,30.28
  Horizontal 0.152: v44.7,16.97 43.89,17.78 29.97,17.78 28.04,19.71 28.04,21.13 27.43,21.74 27.03,21.74 26.31,22.45 26.31,22.96 25.7,23.57 23.37,23.57 16.66,30.28 v16.36,30.28
!FRAM_CS
  Top 0.152: U101.57 47.24,24.71 47.24,27.03 49.78,29.57 49.78,32.21 50.09,32.51 51.21,32.51 51.69,32.03 U102.1
!GYRO_CS  (via drill 0.2)
  Top 0.152: U101.7 32.64,18.59 v32.72,18.59 | X503.7 56.13,2.69 v56.08,2.74 | U501.5 62.34,13.78 v61.77,13.21 | U502.5 57.52,9.64 56.9,10.26 v56.9,10.36
  Horizontal 0.152: v32.72,18.59 44.4,18.59 45.72,17.27 56.59,17.27 57.4,16.46 v57.4,12.5 61.06,12.5 v61.77,13.21
  Vertical 0.152: v56.08,2.74 56.08,7.92 55.58,8.43 55.58,9.04 v56.9,10.36 56.9,11.07 57.4,11.58 v57.4,12.5
!IO-LED_AMBER  (via drill 0.2)
  Top 0.152: U801.28 23.37,11.44 v23.37,11.48 | v21.95,7.62 21.95,6.91 22.55,6.3 22.55,5.99 R709.P$1
  Bottom 0.152: v23.37,11.48 23.37,10.16 21.95,8.74 v21.95,7.62
!IO-LED_BLUE
  Top 0.152: U801.27 24.38,9.72 24.38,8.74 24.28,8.64 R712.P$1
!IO-LED_SAFETY
  Top 0.152: U801.26 23.98,9.42 23.98,8.94 23.16,8.13 R710.P$2
!MPU_CS  (via drill 0.2)
  Top 0.152: U101.17 33.98,12.84 34.65,13.51 34.65,13.72 34.85,13.92 v34.85,15.34 | U505.8 63.26,20.05 63.09,20.22 60.25,20.22 v59.84,19.81
  Horizontal 0.152: v34.85,15.34 34.85,15.65 35.36,16.15 41.55,16.15 41.86,16.36 v41.86,16.97 | v41.15,25.6 42.27,26.72 55.17,26.72 55.37,26.52 55.37,24.38 55.17,24.18 55.17,23.37 v55.78,22.76
  Vertical 0.152: v41.86,16.97 41.86,24.89 v41.15,25.6 | v59.84,19.81 56.79,19.81 55.98,20.62 55.98,22.55 v55.78,22.76
!SBUS_OUTPUT_EN  (via drill 0.2)
  Top 0.152: U903.7 12.62,2.05 12.39,1.83 12.39,0.51 12.6,0.3 13.92,0.3 15.24,1.63 15.24,2.23 15.65,2.64 17.17,2.64 17.48,2.95 v17.48,3.56 | v26.11,13.82 24.69,15.24 24.69,15.61 U801.40
  Horizontal 0.152: v26.11,13.82 26.11,11.68 22.96,8.53 22.96,2.54 22.25,1.83 18.29,1.83 17.48,2.74 v17.48,3.56
!SPI_EXT_NSS  (via drill 0.2)
  Top 0.152: U101.3 30.38,19.16 v30.38,19.51
  Horizontal 0.152: v35.87,33.33 42.06,33.33 43.38,32 v52.73,32
  Vertical 0.152: v35.87,33.33 33.93,31.39 33.93,23.37 30.38,19.81 v30.38,19.51
  Bottom 0.15: 53.07,31.67 53.82,31.67 53.95,31.8 54.36,31.8 54.56,31.6 56.74,31.6 J403.5
  Bottom 0.152: 53.07,31.67 v52.73,32
!VBUS_VALID  (via drill 0.2)
  Top 0.152: RN1101.2 57.96,27.79 v58.01,27.74 | U1101.P$9 61.62,30.84 61.16,30.38 60.86,30.38 v60.76,30.28 | U101.15 34.34,14.63 v34.34,15.85
  Horizontal 0.152: v34.34,15.85 34.34,16.05 35.56,17.27 40.95,17.27 v41.25,16.97 | v40.03,25.6 40.64,24.99 41.25,24.99 42.67,26.42 52.12,26.42 !VBUS_VALID1116.P$1
  Vertical 0.152: !VBUS_VALID1116.P$1 54.66,25.3 55.17,25.81 55.17,27.53 55.37,27.74 v58.01,27.74 60.35,27.74 60.76,28.14 v60.76,30.28 | v41.25,16.97 41.25,24.38 v40.03,25.6
  other vias: 53.24,25.3
!VDD_5V_HIPOWER_OC  (via drill 0.2)
  Top 0.15: R602.P$1 39.47,32.66 38.41,33.73 v38.41,34.34
  Top 0.152: U101.41 v43.69,16.56 | v38.41,34.34 38.44,34.38 U601.4
  Vertical 0.152: v43.69,16.56 43.69,25.3 40.44,28.55 40.44,31.7 38.41,33.73 v38.41,34.34
!VDD_5V_PERIPH_EN  (via drill 0.2)
  Top 0.152: U101.67 43.28,27.82 v43.28,27.94 | R615.P$1 v61.06,27.23 61.12,27.17 U602.5 | v39.12,34.34 39.12,36.75 U601.5
  Horizontal 0.152: 60.86,27.03 v61.06,27.23 60.45,26.62 58.93,26.62 58.52,26.21 57.51,26.21 55.98,27.74 55.07,27.74 54.86,27.94 51,27.94 50.09,27.03 44.2,27.03 v43.28,27.94
  Vertical 0.152: v43.28,27.94 40.74,30.48 40.74,31.9 39.12,33.53 v39.12,34.34
!VDD_5V_PERIPH_OC  (via drill 0.2)
  Top 0.15: v56.08,24.59 57.1,25.6 R604.P$1
  Top 0.152: U602.4 63.54,27.57 v63.6,27.64 | v46.23,19.3 46.02,19.1 46.02,17.75 U101.46
  Horizontal 0.15: v56.08,24.59 62.38,24.59 63.5,25.7 63.5,27.53 v63.6,27.64
  Horizontal 0.152: v46.94,27.84 50.09,27.84 50.8,28.55 54.76,28.55 55.27,28.04 56.39,28.04 57.51,26.92 58.62,26.92 59.33,27.64 60.66,27.64 60.76,27.74 61.37,27.74 61.47,27.64 v63.6,27.64
  Vertical 0.152: v46.94,27.84 45.82,26.72 45.82,25.81 46.23,25.4 46.23,20.52 45.92,20.22 45.92,19.51 v46.23,19.3
!VDD_BRICK_VALID  (via drill 0.2)
  Top 0.152: U101.91 30.59,25.4 v30.48,25.4 | RN1101.4 57.87,28.92 v58.12,29.16 | U1101.P$7 60.08,31.43 v59.84,31.19 | !VDD_BRICK_VALID1116.P$1 52.93,26.11 52.43,25.6 52.43,24.99 52.93,24.49 v52.93,24.08
  Horizontal 0.152: v31.19,32.11 33.22,32.11 33.53,31.8 38.2,31.8 39.22,30.79 53.65,30.79 53.85,30.58 54.36,30.58 54.56,30.79 59.44,30.79 v59.84,31.19
  Vertical 0.152: v30.48,25.4 31.19,26.11 v31.19,32.11 | v59.84,31.19 58.12,29.46 v58.12,29.16 57.61,29.67 53.85,29.67 52.93,28.75 52.93,26.01 52.53,25.6 52.53,24.99 52.93,24.59 v52.93,24.08
!VDD_SERVO_VALID  (via drill 0.2)
  Top 0.152: U101.93 31.39,23.18 v31.39,22.76 | RN1101.3 57.96,28.29 v58.22,28.55 | U1101.P$8 61.12,30.95 60.96,30.79 60.35,30.79 v60.25,30.68 | !VDD_SERVO_VALID1116.P$1 54.36,26.21 v54.05,25.91
  Horizontal 0.152: v31.7,31.6 33.22,31.6 33.33,31.5 36.47,31.5 37.49,30.48 53.44,30.48 53.75,30.18 54.46,30.18 54.76,30.48 59.64,30.48 59.84,30.68 v60.25,30.68
  Vertical 0.152: v31.39,22.76 31.7,23.06 v31.7,31.6 | v54.05,25.91 53.34,26.62 53.34,28.25 53.65,28.55 v58.22,28.55 58.52,28.55 58.73,28.75 60.05,28.75 60.25,28.96 v60.25,30.68
ACCEL_DRDY  (via drill 0.2)
  Top 0.152: U504.11 63.2,3.86 v62.99,4.06 | v31.9,18.59 31.9,20.32 32.61,21.03 32.61,24.08 U101.90 | v58.12,2.85 58.12,1.24 X503.3
  Horizontal 0.152: v62.99,4.06 59.33,4.06 v58.12,2.85 57.2,1.93 48.97,1.93 47.24,3.66 44.09,3.66 43.89,3.66 39.01,3.66 36.17,6.5 v32.72,6.5
  Vertical 0.152: v31.9,18.59 33.02,17.48 33.02,6.81 v32.72,6.5
ALARM  (via drill 0.2)
  Top 0.152: U101.77 37.34,28.55 v38.41,28.55 | R701.P$2 8.85,28.34 v9.35,27.84
  Horizontal 0.152: v38.41,28.55 32.51,28.55 28.65,32.41 16.97,32.41 15.14,34.24 10.06,34.24 9.35,33.53 v9.35,27.84
BATT_CURRENT_SENS  (via drill 0.2)
  Top 0.152: U101.26 40.03,9.6 v40.03,9.04 | v59.03,28.25 59.13,28.35 R1101.P$1
  Horizontal 0.152: v38.91,27.84 39.52,28.45 50.19,28.45 50.7,28.96 54.86,28.96 55.47,28.35 56.59,28.35 57.71,27.23 58.42,27.23 58.62,27.43 58.62,27.84 v59.03,28.25
  Vertical 0.152: v40.03,9.04 40.03,10.06 38.81,11.28 38.81,23.67 39.32,24.18 39.32,27.43 v38.91,27.84
BATT_CURRENT_SENS_PROT  (via drill 0.2)
  Top 0.152: v63.6,28.35 L1101.P$1 | R1104.P$1 v64.62,26.72
  Vertical 0.152: v64.62,26.72 64.62,27.33 v63.6,28.35
  Bottom 0.152: J601.3 65.72,34.15 66.14,33.73 66.14,29.46 65.02,28.35 v63.6,28.35
BATT_VOLTAGE_SENS  (via drill 0.2)
  Top 0.152: U101.25 37.14,10.36 v37.8,10.36 | v58.93,29.46 R1102.P$1
  Horizontal 0.152: v37.69,29.87 37.9,30.07 53.34,30.07 53.54,29.87 54.66,29.87 54.86,30.07 58.32,30.07 v58.93,29.46
  Vertical 0.152: v37.8,10.36 36.88,11.28 36.88,26.11 37.69,26.92 v37.69,29.87
BATT_VOLTAGE_SENS_PROT  (via drill 0.2)
  Top 0.152: L1102.P$1 63.39,29.36 v63.6,29.36 | R1103.P$1 v64.62,25.6
  Vertical 0.152: v64.62,25.6 65.13,26.11 65.13,27.84 v63.6,29.36
  Bottom 0.152: J601.4 65.45,32.9 65.84,32.51 65.84,29.67 65.53,29.36 v63.6,29.36
CAN1_RX  (via drill 0.2)
  Top 0.152: v36.17,26.92 36.14,26.92 U101.81 | U401.4 41.7,2.48 v42.16,2.95
  Horizontal 0.152: v42.16,2.95 38.91,2.95 v38.2,3.66
  Vertical 0.152: v38.2,3.66 36.58,5.28 36.58,26.52 v36.17,26.92
CAN1_TX  (via drill 0.2)
  Top 0.152: v35.46,26.92 35.43,26.92 U101.82 | U401.1 38.66,2.48 v38.2,2.95
  Vertical 0.152: v35.46,26.92 36.27,26.11 36.27,4.88 v38.2,2.95
CAN2_RX
  Top 0.152: U101.51 49.13,22.36 R216.P$1
CAN2_TX
  Top 0.152: U101.92 30.39,24.89 30.07,24.89 29.87,25.09 R215.P$1
CAN_H  (via drill 0.2)
  Top 0.152: U401.7 39.91,5.61 39.52,5.99 v39.52,6.3 v39.53,6.31 R409.P$1
  Bottom 0.152: CAN_H1116.P$1 v39.52,6.3 39.93,6.71 40.44,6.71 40.83,6.32 J405.2
CAN_L  (via drill 0.2)
  Top 0.152: U401.6 40.56,5.77 v40.23,6.1 40.53,6.39 R409.P$2
  Bottom 0.152: J405.3 40.42,5.07 | 40.42,5.07 CAN_L1116.P$1 | 40.42,5.07 40.42,5.91 v40.23,6.1
FMU-!RESET  (via drill 0.2)
  Top 0.15: U603.3 55.62,13.87 v55.27,13.51
  Top 0.152: v49.07,15.24 49.07,16 U701.4 | v33.73,14.73 U101.14 | S601.A1 28.85,37.48 C609.P$2 29.36,37.19 v29.36,36.27 | v52.32,13.51 52.32,13.11 52.53,12.9 53.13,12.9 53.14,12.9 R635.P$1
  Horizontal 0.152: v27.53,20.93 27.53,19.71 30.58,16.66 31.5,16.66 31.8,16.97 32.41,16.97 32.72,16.66 32.72,15.75 v33.73,14.73 48.56,14.73 v49.07,15.24 49.17,15.34 50.49,15.34 v52.32,13.51 v55.27,13.51
  Vertical 0.152: v27.53,20.93 29.36,22.76 v29.36,36.27
FMU-BOOT0  (via drill 0.2)
  Top 0.152: U101.94 29.49,24.38 R611.P$2 27.42,25.41 v27.23,25.6
  Bottom 0.152: FMU-BOOT1101.P$1 26.82,25.6 v27.23,25.6
FMU-CH1  (via drill 0.2)
  Top 0.152: v45.72,20.73 45.72,17.34 U101.45 | U901.7 16.32,36.51 17.07,35.76 17.07,32.51 v18.49,31.09
  Horizontal 0.152: v45.72,20.73 45.52,20.93 35.56,20.93 31.6,24.89 24.08,24.89 18.49,30.48 v18.49,31.09
FMU-CH1-PROT
  Top 0.406: R913.P$2 7.34,38.2 J901.46
FMU-CH2  (via drill 0.2)
  Top 0.152: U101.44 45.21,17.15 v45.21,20.32 | U901.6 16.11,36.01 16.76,35.36 16.76,32.11 v17.78,31.09
  Horizontal 0.152: v45.21,20.32 44.91,20.62 35.36,20.62 31.39,24.59 23.88,24.59 17.78,30.68 v17.78,31.09
FMU-CH3  (via drill 0.2)
  Top 0.152: U101.42 44.2,16.75 v44.2,19.81 | U901.5 15.9,35.51 16.46,34.95 16.46,31.7 v17.07,31.09
  Horizontal 0.152: v44.2,19.81 43.69,20.32 35.15,20.32 31.19,24.28 23.67,24.28 17.07,30.89 v17.07,31.09
FMU-CH4  (via drill 0.2)
  Top 0.152: U101.40 43.18,16.35 v43.18,19.81 | U901.4 15.89,35.01 16.15,34.75 16.15,31.29 v16.36,31.09
  Horizontal 0.152: v43.18,19.81 35.15,19.81 31.09,23.88 23.57,23.88 v16.36,31.09
FMU-CH5  (via drill 0.2)
  Top 0.152: U101.60 44.28,23.88 v42.57,23.88 | v15.65,31.6 15.85,31.8 15.85,34.34 15.68,34.51 U901.3
  Horizontal 0.152: v42.57,23.88 42.16,23.47 36.58,23.47 28.25,31.8 15.85,31.8 v15.65,31.6
FMU-CH6  (via drill 0.2)
  Top 0.152: U101.61 43.88,24.18 43.18,24.18 v42.98,24.38 | U901.1 15.16,32.51 v15.24,32.51
  Horizontal 0.152: v42.98,24.38 42.27,24.38 41.66,23.77 36.78,23.77 28.45,32.11 15.65,32.11 v15.24,32.51
FMU-CH6-PROT
  Top 0.406: R902.P$2 8.53,32.11 8.23,31.8 8.23,30.18 7.72,29.67 7.72,27.96 J901.31
FMU-I2C1_SCL  (via drill 0.2)
  Top 0.152: U101.95 31.09,22.08 v31.09,22.05 | R404.P$1 R401.P$1 v43.98,2.63 v43.99,2.64
  Horizontal 0.152: v43.99,2.64 43.18,2.64 42.47,1.93 35.66,1.93 35.46,1.73 32.41,1.73 31.9,2.23 31.29,2.23 v30.79,1.73
  Vertical 0.152: v31.09,22.05 30.48,22.66 29.87,22.66 28.04,20.83 28.04,4.47 v30.79,1.73
FMU-I2C1_SDA  (via drill 0.2)
  Top 0.152: U101.96 30.48,21.98 v30.48,21.95 | R405.P$1 R402.P$1 43.38,0.3 42.57,0.3 42.27,0.61 v42.27,1.22
  Horizontal 0.152: v42.27,1.22 41.66,0.61 32.72,0.61 v31.6,1.73
  Vertical 0.152: v30.48,21.95 30.18,22.25 29.97,22.25 28.35,20.62 28.35,4.98 v31.6,1.73
FMU-I2C2_SCL
  Top 0.152: U701.3 R306.P$1 49.49,16.98 49.17,16.66 47.82,16.66 U101.47
FMU-I2C2_SDA
  Top 0.152: U701.2 50.08,16.26 R307.P$1 50.69,16.98 50.19,17.48 48.87,17.48 48.56,17.17 48.02,17.17 U101.48
FMU-SWCLK  (via drill 0.2)
  Top 0.152: U101.76 37.08,30.11 v37.08,30.18
  Bottom 0.152: JX301.4 32.97,20.57 32.72,20.83 32.72,22.35 33.73,23.37 33.73,27.94 35.97,30.18 v37.08,30.18
FMU-SWDIO  (via drill 0.2)
  Top 0.152: v39.73,27.94 39.86,27.94 U101.72
  Bottom 0.152: v39.73,27.94 38.41,29.26 35.56,29.26 34.04,27.74 34.04,23.37 34.54,22.86 JX301.2
FMU-SWO  (via drill 0.2)
  Top 0.152: v32.41,19.3 32.31,19.41 32.31,20.22 32.92,20.83 32.92,24.49 U101.89
  Bottom 0.152: v32.41,19.3 JX301.6
FMU-UART4_RX
  Top 0.152: U101.24 35.66,9.6 35.66,8.74 36.27,8.13 36.27,5.99 36.98,5.28 36.98,4.67 36.81,4.5 U202.8
FMU-UART4_TX
  Top 0.152: U101.23 35.36,10 35.36,8.53 35.97,7.92 35.97,5.33 U202.9
FMU-UART7_RX  (via drill 0.2)
  Top 0.152: U202.4 35.52,2.5 v35.26,2.23 | U101.38 42.88,15.24 v42.67,15.24
  Horizontal 0.152: v35.46,15.24 v42.67,15.24
  Vertical 0.152: v35.26,2.23 35.5,2.23 35.87,2.6 35.87,3.25 34.65,4.47 34.65,9.55 35.66,10.57 35.66,15.04 v35.46,15.24
FMU-UART7_TX  (via drill 0.2)
  Top 0.152: 44.19,14.63 U101.39 45.01,13.81 v45.01,13.51 | U202.5 v35.31,3
  Horizontal 0.152: v35.31,3 36.08,2.23 42.16,2.23 43.08,3.15 v44.5,3.15
  Vertical 0.152: v44.5,3.15 44.5,10.67 45.01,11.18 v45.01,13.51
FMU-UART8_RX  (via drill 0.2)
  Top 0.152: U202.6 34.79,3.5 34.54,3.25 v34.54,2.95 | U101.97 30.38,21.37 v30.38,21.34
  Vertical 0.152: v34.54,2.95 31.8,2.95 28.96,5.79 28.96,19.61 30.38,21.03 v30.38,21.34
FMU-UART8_TX  (via drill 0.2)
  Top 0.152: U202.7 36.23,4.06 34.14,4.06 33.73,3.66 v33.73,2.44 | v29.77,21.23 29.77,21.27 U101.98
  Vertical 0.152: v33.73,2.44 31.7,2.44 28.65,5.49 28.65,20.12 v29.77,21.23
FMU-USART2_CTS
  Top 0.152: U201.9 32.62,28.32 U101.84
FMU-USART2_RTS
  Top 0.152: U101.85 32.6,27.64 30.28,27.64 30.1,27.81 U201.8
FMU-USART2_RX
  Top 0.152: U101.87 31.8,27.03 29.67,27.03 29.1,27.59 U201.6
FMU-USART2_TX
  Top 0.152: U101.86 32.2,27.33 29.97,27.33 29.6,27.7 U201.7
FMU-USART3_CTS  (via drill 0.2)
  Top 0.152: U101.58 44.91,23.08 v44.91,22.96 | v27.64,26.52 27.6,26.55 U201.3
  Horizontal 0.152: v44.91,22.96 43.79,21.84 36.17,21.84 31.29,26.72 27.84,26.72 v27.64,26.52
FMU-USART3_RTS  (via drill 0.2)
  Top 0.152: U101.59 44.48,23.37 v43.08,23.37 | v25.91,29.77 26.35,29.32 U201.1
  Horizontal 0.152: v43.08,23.37 42.88,23.16 36.37,23.16 29.77,29.77 v25.91,29.77
FMU-USART3_RX  (via drill 0.2)
  Top 0.152: U101.56 45.52,22.28 v45.52,22.25 | v28.14,26.11 28.1,26.15 U201.4
  Horizontal 0.152: v45.52,22.25 44.81,21.54 35.97,21.54 31.09,26.42 28.45,26.42 v28.14,26.11
FMU-USART3_TX  (via drill 0.2)
  Top 0.152: U101.55 45.72,21.77 v45.72,21.64 | v28.85,25.91 28.6,26.16 U201.5
  Horizontal 0.152: v45.72,21.64 45.31,21.23 35.76,21.23 31.09,25.91 v28.85,25.91
FMU-VDD_3V3  (via drill 0.2, 0.3)
  Top 0.15: R604.P$2 56.09,25.61 55.47,24.99 55.47,24.18 v55.78,23.88
  Top 0.25: v39.83,31.29 39.83,31.8 R602.P$2
  Top 0.254: 15.14,34.04 U901.2 15.16,33.55 v15.04,33.43 | U101.11 30.69,13.82 v30.48,13.82 29.57,13.82 C610.P$1 | U101.22 34.76,10.11 C612.P$1 34.65,9.95 34.65,7.72 35.04,7.32 C202.P$1 35.29,6.66 U202.10 | C101.P$1 41.34,9.7 U101.28 39.46,11.58 v39.42,11.58 36.92,11.58 36.58,11.92 36.51,11.86 | C402.P$1 41.45,1.22 v41.55,1.32 42.27,2.03 R401.P$2 R402.P$2 | U401.3 40.56,1.39 C402.P$1 | C402.P$1 40.73,0.91 40.23,0.41 37.39,0.41 U202.2 36.27,1.52 35.76,1.52 35.56,1.73 33.53,1.73 33.3,1.5 U202.19 | U101.50 48.3,18.69 49.58,18.69 | 49.58,18.69 50.39,18.69 | v48.36,19.1 48.36,18.76 U101.50 | 48.15,18.5 U101.50 | v11.79,33.43 11.66,33.55 U901.19 | C201.P$1 31.86,29.32 U201.10 | v51.71,24.38 51.71,25.81 U102.8 U102.7 | U102.3 49.15,29.84 v48.77,29.46 47.9,28.6 R304.P$2 R305.P$2 | C201.P$1 32.52,29.57 R303.P$2 R302.P$2 R301.P$2 | v33.02,29.26 32.42,29.26 C201.P$1 | R306.P$2 49.58,18.69 | R307.P$2 50.8,18.29 50.39,18.69 | U101.75 40.59,30.79 C606.P$1 40.34,31.29 v39.83,31.29 | U101.22 36.51,11.86 | U101.21 U101.22 | U101.19 35.53,13.01 36.51,12.03 36.51,11.86 | U101.100 27.18,22.45 v27.13,22.45 26.61,22.45 C608.P$1 | v26.42,27.94 26.8,28.32 U201.2 27.13,28.35 27.13,28.85 27.33,29.06 27.33,31.09 27.1,31.32 U201.19 26.09,31.82 25.7,32.21 D2.A | C607.P$1 51.21,19.51 50.39,18.69 | U701.10 51,13.68 51,15.65 | 51,15.65 50.64,16 U701.1 | 51,15.65 C701.P$1 52.42,15.64 v52.43,15.65 | C902.P$1 14.16,39.07 U901.10 14.54,38.01 v14.73,38.2
  Bottom 0.254: VDD_3V1101.P$1 40.64,30.99 C606.P$1 40.08,31.04 v39.83,31.29 | v14.73,38.2 15.04,37.9 v15.04,33.43
  Bottom 0.406: v11.79,33.43 v15.04,33.43 | JX301.1 v38.61,24.38 | U301.4 66,20.16 66.24,19.91 66.24,15.14 65.84,14.73 59.03,14.73 v58.62,14.33
  pour Power: 28.85,1.32 28.85,17.07 21.13,24.79 14.12,24.79 14.12,33.73 42.67,33.73 42.67,30.68 58.72,30.68 58.72,1.32
  pour Top (isolate 0.254, rank 2, no thermals): 57.3,14.63 58.42,14.63 58.52,14.73 58.52,14.94 58.72,15.14 59.54,15.14 59.64,15.04 59.64,11.18 59.44,10.97 58.72,10.97 58.52,11.18 58.52,14.02 58.42,14.12 57.3,14.12
FMU-VDD_5V5
  pour Top (isolate 0.254, rank 2, no thermals): 53.04,15.34 56.08,15.34 56.39,15.04 56.39,12.7 56.08,12.4 52.83,12.4 52.53,12.7 52.53,15.04 52.83,15.34
FMU_AUX_ADC1  (via drill 0.2)
  Top 0.152: R408.P$1 37.7,8.95 v37.59,8.84 | v35.15,13.51 35.15,13.33 U101.18
  Bottom 0.152: v37.59,8.84 35.15,11.28 v35.15,13.51
FMU_AUX_ADC1_PROT  (via drill 0.2)
  Top 0.152: R408.P$2 38.7,10.07 v38.61,10.16
  Bottom 0.152: J404.4 45.24,19.07 46.02,18.29 46.02,14.33 45.82,14.12 43.08,14.12 39.12,10.16 v38.61,10.16
FMU_AUX_ADC2
  Top 0.152: U101.33 43.25,11.33 R407.P$1
FMU_AUX_ADC2_PROT  (via drill 0.2)
  Top 0.152: 44.3,10.57 R407.P$2 44.5,10.88 v44.5,11.58
  Bottom 0.152: v44.5,11.58 46.33,13.41 46.33,18.49 43.25,21.57 J404.2
FRAM_MISO
  Top 0.152: U101.53 48.46,23.1 48.46,27.13 50.42,29.08 U102.2
FRAM_MOSI
  Top 0.152: U101.54 47.88,23.23 U102.5
FRAM_SCK
  Top 0.152: U101.52 48.77,22.7 48.77,23.98 49.15,24.36 U102.6
GND  (via drill 0.2, 0.3)  (210 unrouted)
  Top 0.15: v55.07,14.12 55.27,14.33 55.95,14.33 U603.2 | C1101.P$2 69.12,39.25 v69.39,39.52 | C1110.P$2 58.23,30.08 57.61,29.46 55.78,29.46 v55.47,29.16
  Top 0.152: C1107.P$2 65.23,31.5 65.53,31.8 66.34,31.8 66.65,32.11 v66.65,32.72 | C1106.P$2 65.23,35.77 65.53,36.07 65.94,36.07 v66.34,36.47 | C615.P$2 52.93,13.82 v52.63,14.12 | 16.26,5.58 16.26,5.59 | C1108.P$2 58.82,35.26 v58.83,35.26 | C1109.P$2 v58.72,32.72 v58.73,32.72 | L402.P$3 L402.P$5 L402.P$4 | L1102.P$3 L1102.P$5 L1102.P$4
  Top 0.2: v63.2,16.15 C514.P$2 | C512.P$2 v62.38,17.07 | U505.1 66.98,22.02 v66.95,22.05 | v69.49,21.13 69.49,20.42 69.23,20.16 C515.P$2 | U505.18 66.98,16.57 C513.P$2 | C1003.P$2 10.63,8.39 v10.57,8.33
  Top 0.25: C1005.P$2 16.26,4.78 16.26,5.58 R1001.P$1 | 16.26,5.59 16.26,6.81 16.76,7.32 17.37,7.32 | 33.77,10.94 34.17,10.94 U101.20 | 33.78,10.55 33.78,10.92 33.77,10.94 | 33.77,10.94 v33.73,10.97 | C1004.P$2 v13.51,11.18 13.61,11.27 C1002.P$2 | v58.22,3.86 58.32,3.86 | v58.83,5.69 59.03,5.89 U502.12 | v61.98,9.35 61.36,9.35 | 61.46,8.32 C505.P$2 C503.P$2 61.36,9.35 | v65.73,10.06 65.75,10.04 U506.2 U506.3 | 61.27,9.35 61.36,9.35 | C1008.P$2 9.05,9.03 9.14,8.94 v9.45,8.94
  Top 0.254: U501.10 U501.11 U501.12 65.8,10.97 66.65,10.97 66.65,11.18 | U501.10 U501.9 | 64.52,9.14 U506.3 | U504.13 U504.12 65.32,3.36 v65.43,3.25 | U504.5 66.13,4.86 65.43,4.17 v65.43,3.25 | C502.P$2 C504.P$2 69.18,11.79 | 65.8,9.17 U506.2 | 64.52,10.88 U501.10 | v65.43,3.25 65.63,3.06 U504.16 65.63,2.04 66.28,1.39 C509.P$2 | U504.10 64.32,4.36 v65.43,3.25 | R702.P$2 8.13,27.23 v8.13,25.4 8.13,24.79 C703.P$2 | R706.P$2 10.35,31.39 C704.P$2 11.07,32 v10.97,32.11 | U801.47 23.03,18.9 22.76,18.9 21.45,20.21 C803.P$2 | C803.P$2 21.39,20.67 | v20.32,20.73 C803.P$2 | 63.84,10.9 U501.9 | U501.9 63.85,10.97 62.99,10.97 62.99,11.83 U501.8 | 66.65,11.18 66.65,11.83 U501.13 66.76,11.79 69.18,11.79 | U801.35 27.43,12.33 v27.43,12.29 28.38,12.29 X101.2 30.21,12.65 C102.P$2 | C804.P$2 C610.P$2 29.57,15.13 v30.07,14.63 30.8,14.63 U101.10 | 33.78,10.55 C612.P$2 | C103.P$1 32.21,10.97 v33.73,10.97 | U101.27 41.34,8.99 | 41.34,8.99 C101.P$2 | v38.91,1.32 39.01,1.22 C402.P$2 39.91,1.39 U401.2 39.93,2.48 39.93,3.66 | v32.61,5.79 32.9,5.5 U202.11 33.79,6.66 C202.P$2 33.33,6.91 D203.A 32.87,7.57 L203.P$3 | U201.11 31.86,30.82 C201.P$2 32.62,31.09 v32.82,31.09 | U102.4 47.85,31.04 v47.85,29.46 | 40.98,38.56 J301.GND4 | 45.98,38.56 J301.GND1 | 42.3,36.21 J301.GND 41.48,36.21 J301.GND3 | v18.9,16.15 18.9,16.62 U801.8 17.28,18.24 C806.P$1 | D901.A D902.A 11.47,5.58 11.73,5.84 U1001.2 13.26,5.84 | v12.19,16.26 12.26,16.32 U902.11 12.32,17.29 C903.P$2 13.32,19.6 X801.4 15.08,21.79 R919.P$1 | v20.32,20.73 20.32,21.63 D701.A D801.A | U801.23 21.06,10.57 v21.54,10.57 22.45,9.66 C802.P$2 | R704.P$1 51.61,12.51 v51.61,13.41 51.71,13.51 C701.P$2
  Top 0.254: D202.A 23.98,34.23 L202.P$3 L202.P$5 L202.P$4 | C606.P$2 41.75,31.29 | 41.75,31.29 v41.86,31.29 42.11,31.29 C613.P$2 | D404.A 37.08,7.32 L403.P$4 L403.P$5 L403.P$3 | 41.75,31.29 41.75,31.24 U101.74 | R801.P$2 R713.P$2 27.54,20.32 28.85,20.32 29.26,20.73 29.26,21.08 U101.99 27.84,22.5 v27.84,22.66 27.24,23.26 C608.P$2 R611.P$1 | U401.5 41.21,3.66 39.93,3.66 | U401.8 39.26,3.66 39.93,3.66 | U302.2 v43.89,33.73 | v41.05,8.53 41.05,8.7 41.34,8.99 | R102.P$2 45.92,12.3 D403.A 46.24,13.32 L404.P$4 L404.P$5 L404.P$3 48.16,14.43 48.16,15.24 48.58,15.66 U701.5 | X801.2 19.15,20.4 | 19.15,20.4 C805.P$2 | 19.15,20.4 19.47,20.73 v20.32,20.73 | X101.4 29.55,8.72 L203.P$4 | L203.P$4 | L203.P$4 L203.P$5 | L401.P$4 L401.P$5 L401.P$3 62.16,2.24 D401.A | L603.P$3 L603.P$5 L603.P$4 | v67.26,11.18 66.65,11.18 | U502.9 U502.10 U502.11 U502.12 U502.13 | C503.P$2 61.37,9.35 | U903.4 10.12,0.75 v10.16,0.71 | U903.1 10.12,2.7 v10.16,2.74 | C901.P$2 14.36,4.41 U1001.5 U1001.6 13.56,5.34 U1001.P$3 | 17.48,7.28 v17.48,7.32 R802.P$2 | U1001.P$2 13.26,5.84 | U1002.2 13.16,8.38 v13.01,8.53 11.42,8.53 C1003.P$2 | R1002.P$1 v13.82,8.53 | v48.67,20.73 49.01,21.07 C611.P$2 50.7,21.07 | 50.7,21.07 51.16,21.07 C607.P$2 | R610.P$2 50.6,21.16 50.7,21.07 | U702.4 15.71,29.02 v15.75,29.06 15.75,30.52 C702.P$2 | 13.26,5.84 U1001.GND | C801.P$1 25.29,4.38 25.6,4.06 v25.6,1.73 25.49,1.61 S801.B3 21.96,1.61 21.45,2.13 R708.P$1 19.41,2.13 v18.9,2.64 | L201.P$3 L201.P$5 L201.P$4 35.04,36.78 D201.A | L901.P$4 L901.P$5 L901.P$3 10.96,22.77 D903.A | R711.P$1 C902.P$2 12.91,38.26 U901.11 12.85,38.2 v13.31,38.2 | L1101.P$4 L1101.P$5 L1101.P$3
  Top 0.254: U1101.P$10 62.12,32.36 v62.18,32.41 61.87,32.72 U1101.P$25 | 40.03,38.51 R617.P$2 37.94,37.95 U601.6 37.94,36.62 U601.P$3 | U601.2 37.44,36.32 U601.P$2 U601.GND | R615.P$2 R616.P$2 59.44,25.39 v59.74,25.09 | U602.6 62.44,26.67 U602.P$3 | U602.2 62.74,26.17 | 62.74,26.17 U602.P$2 | C609.P$1 27.63,38.7 S601.B3 | 62.74,26.17 62.74,26.27 U602.GND | 69.18,11.79 C508.P$2 69.09,10.88 R403.P$1 68.47,9.95 68.28,9.75 68.28,8.13 | 68.28,8.13 68.48,7.92 C401.P$2 | v67.97,7.52 68.28,7.82 68.28,8.13 | X503.2 58.63,3.45 v58.22,3.86 | C506.P$2 69.22,1.9 v69.19,1.93 v69.18,1.94 C507.P$2 | B601.2 24.07,27.52 v24.08,27.53
  Top 0.4: C1105.P$2 v64.72,39.73